# EAGLE board urdevboard (EAGLE 5.06), part 1 of 3
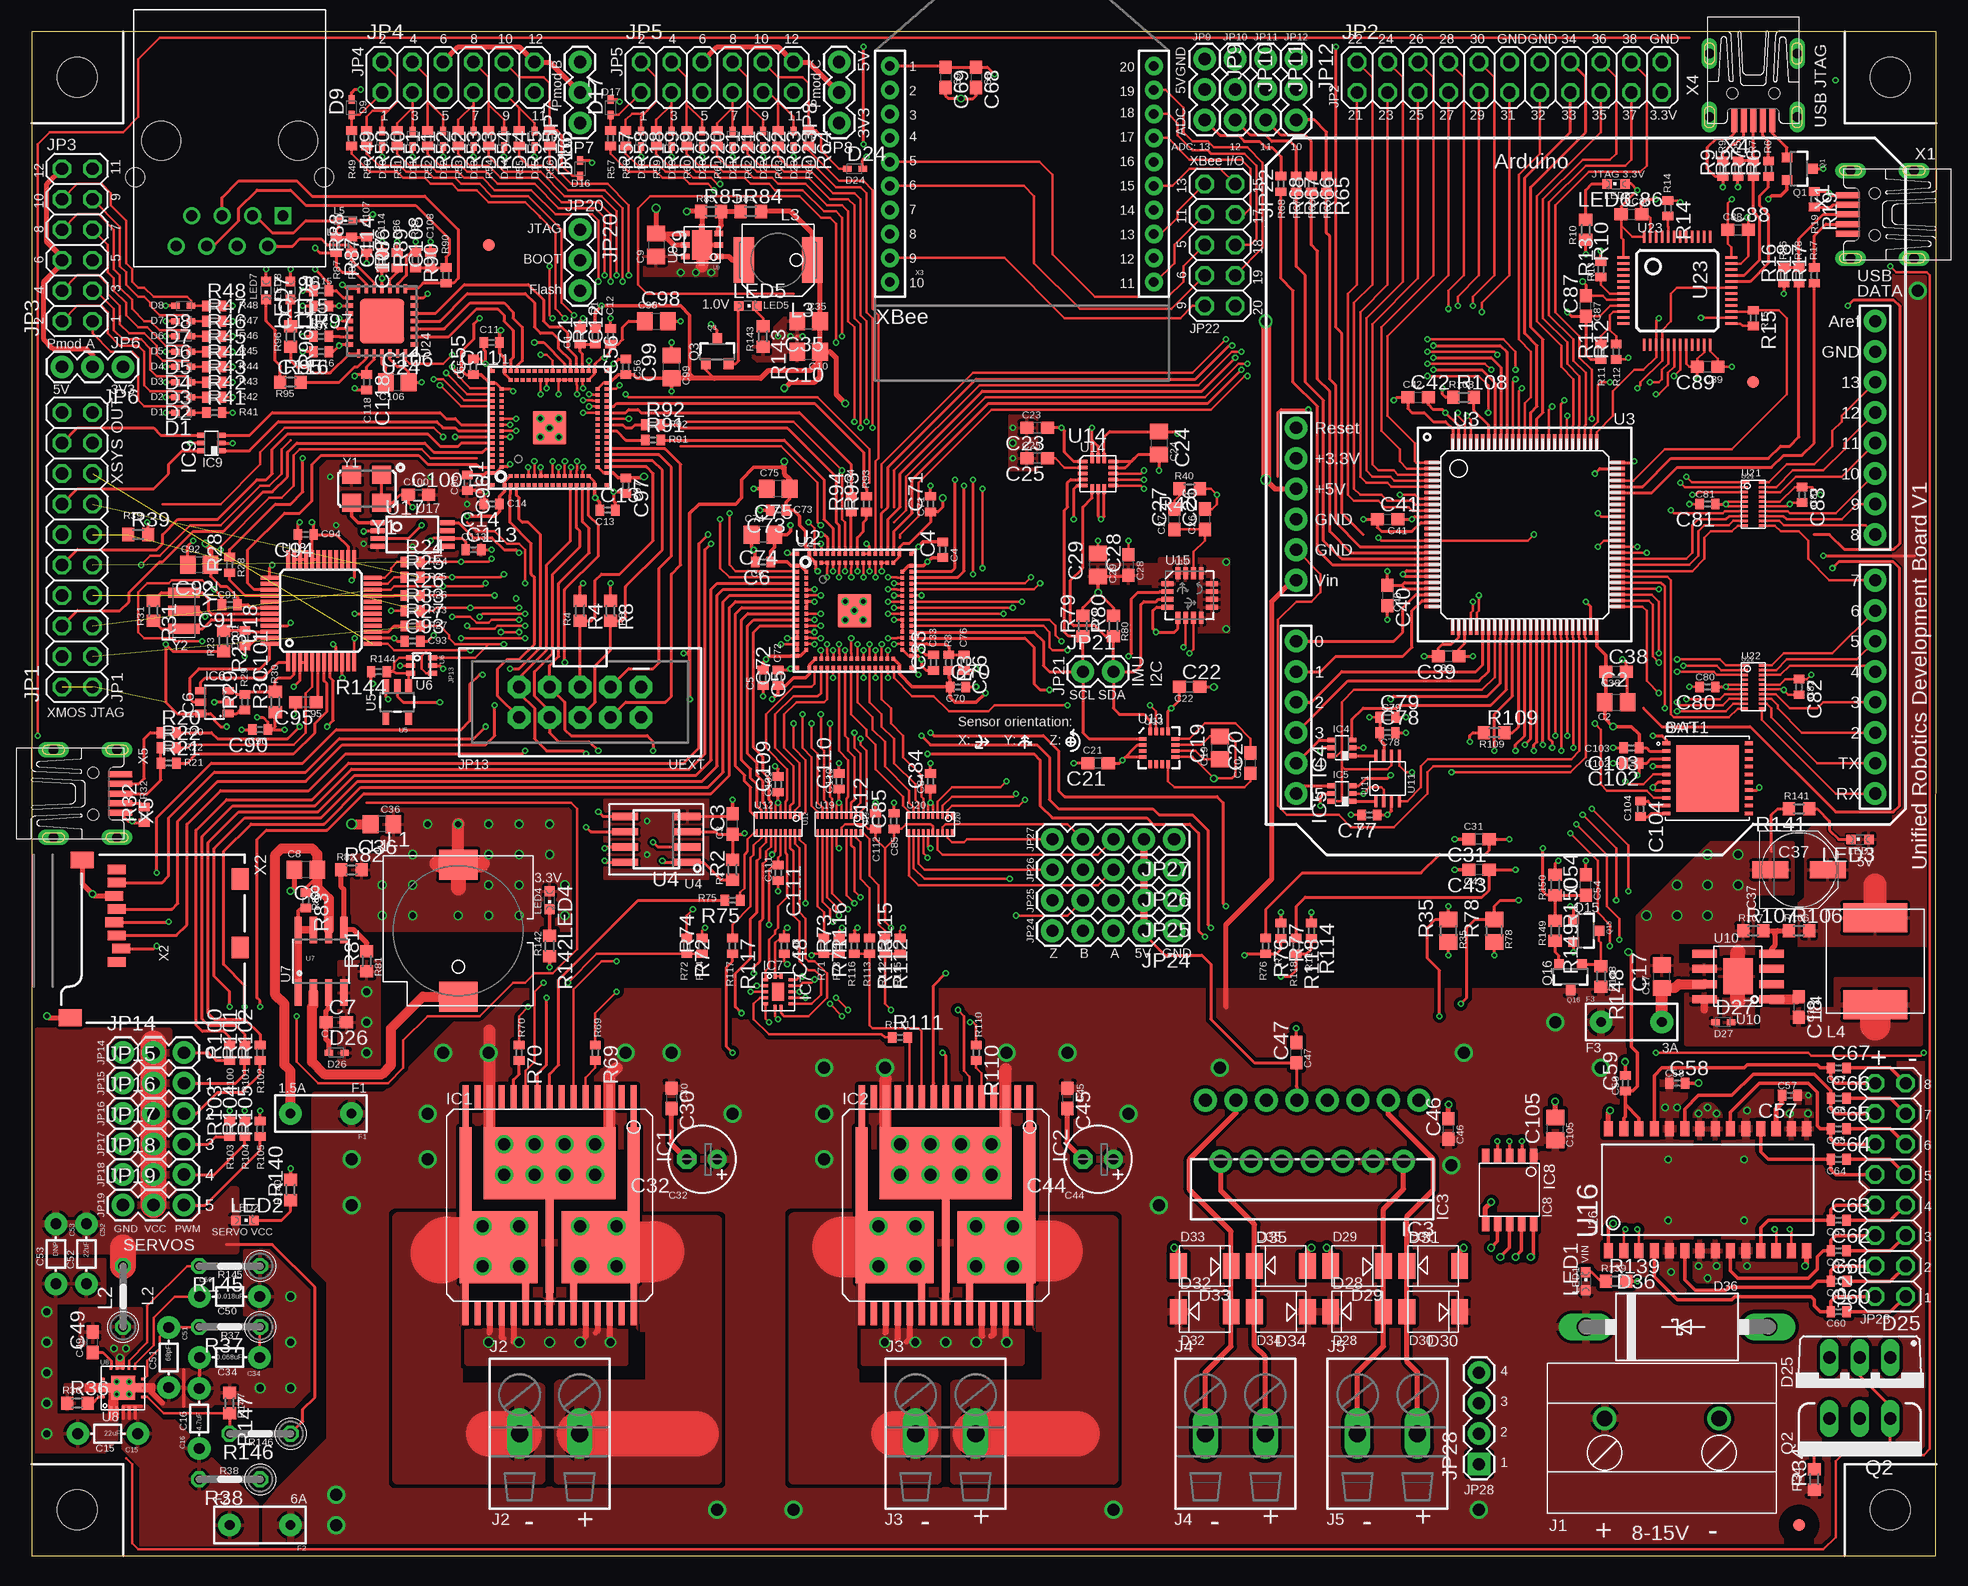
[diagram p16: board, top side]
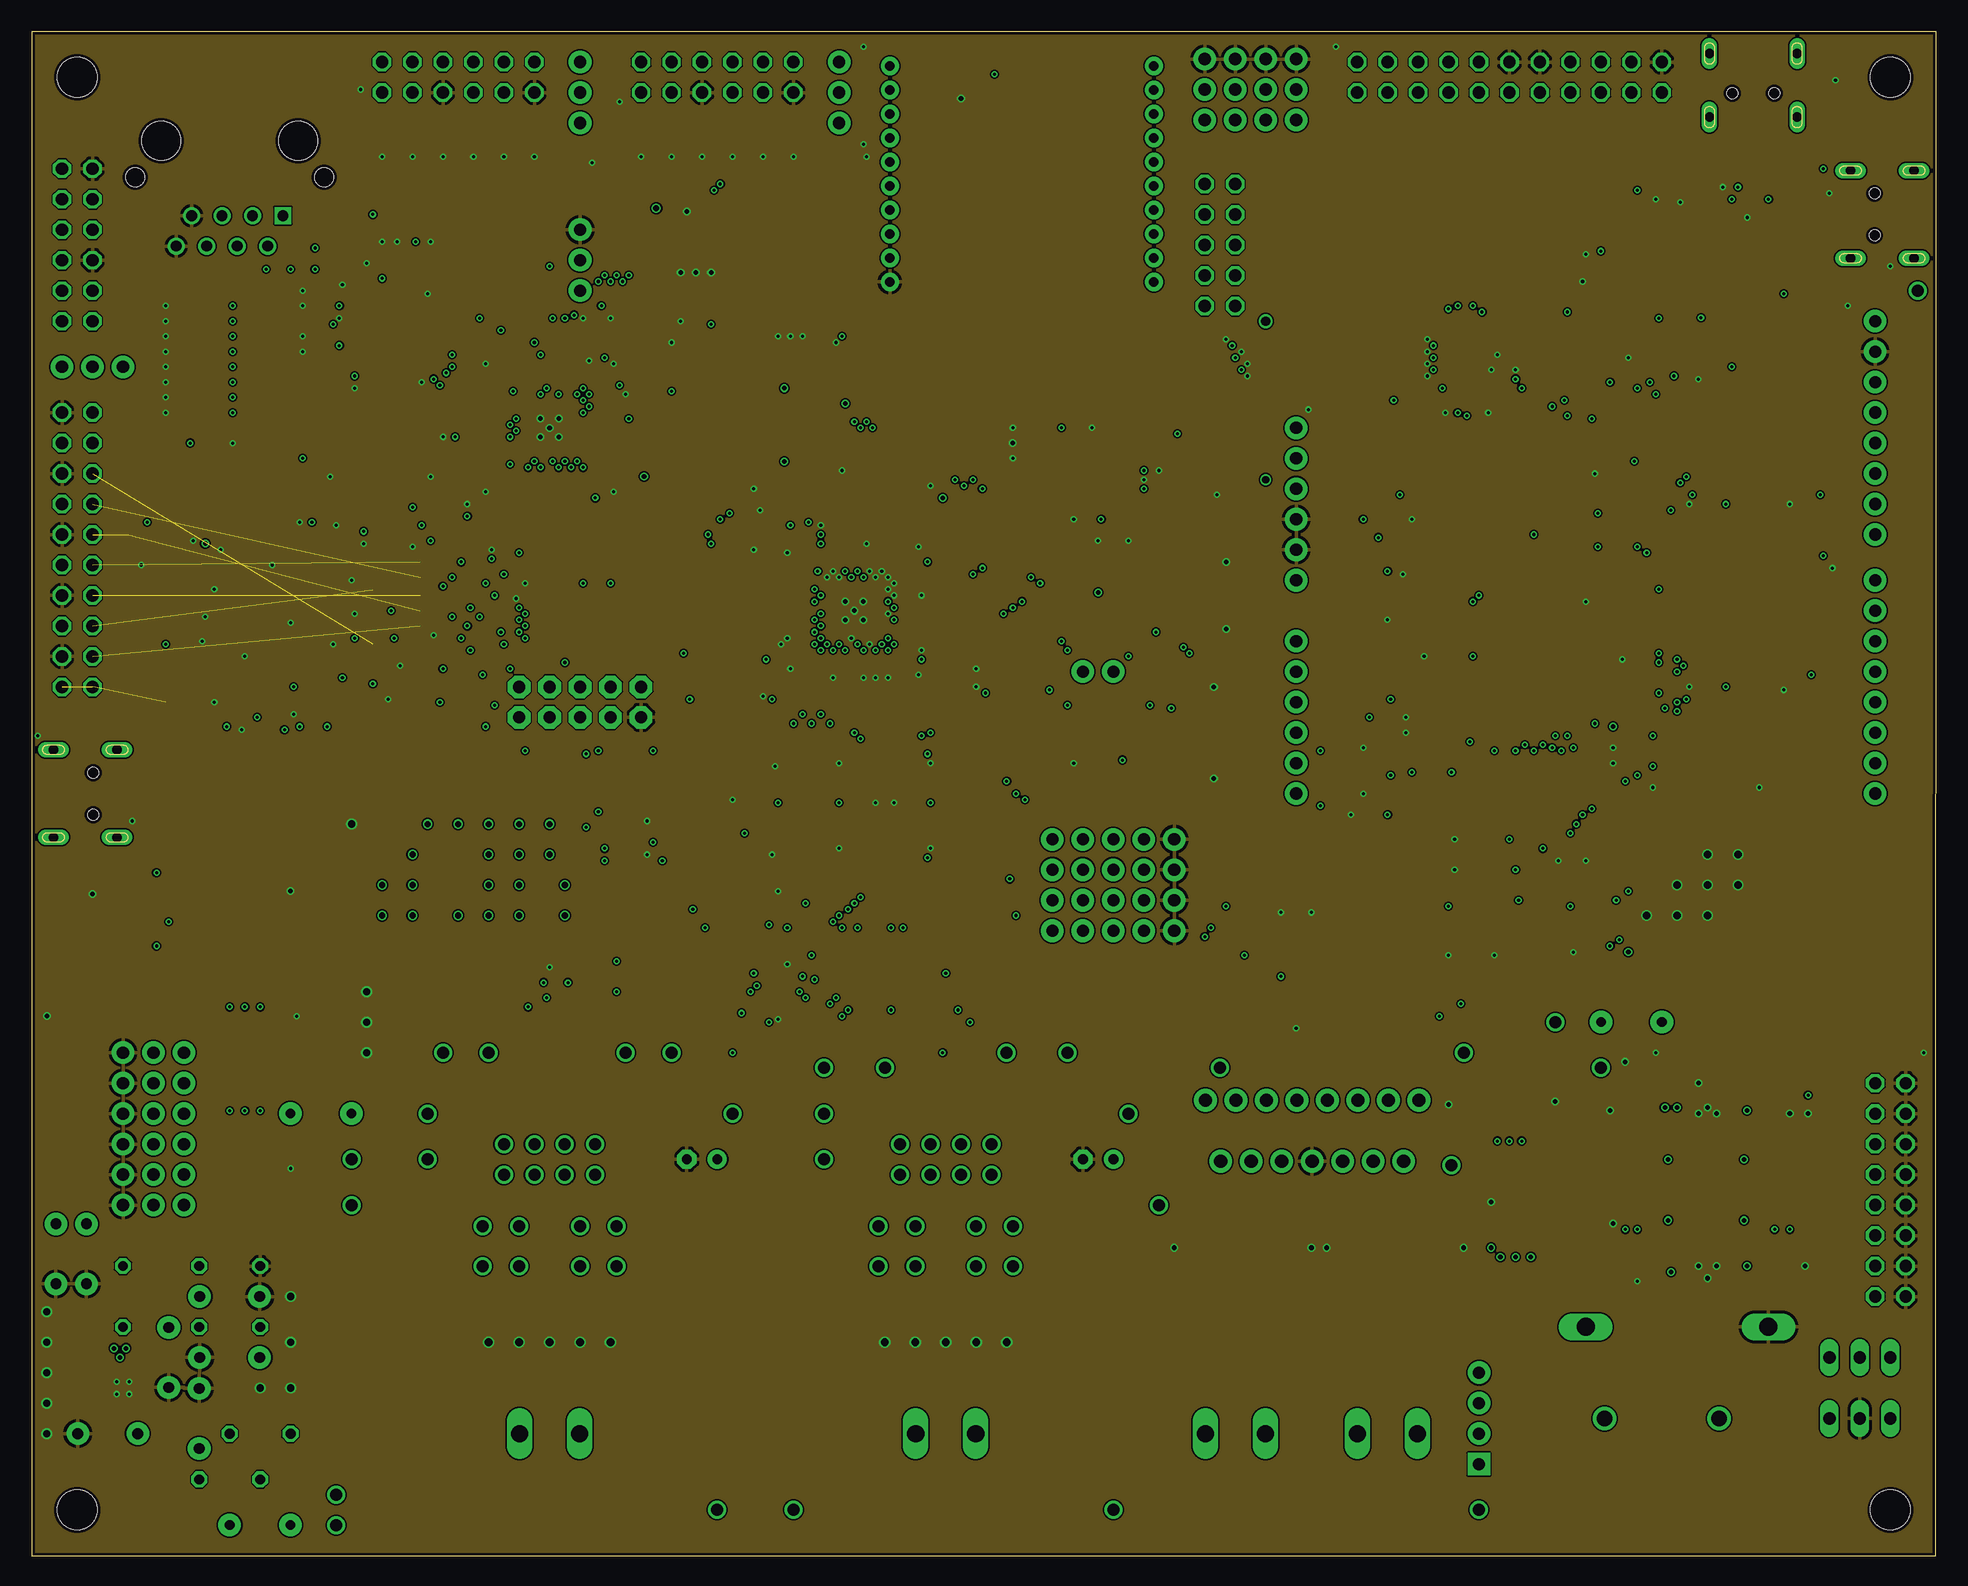
[diagram p17: board, inner layer $Ground]
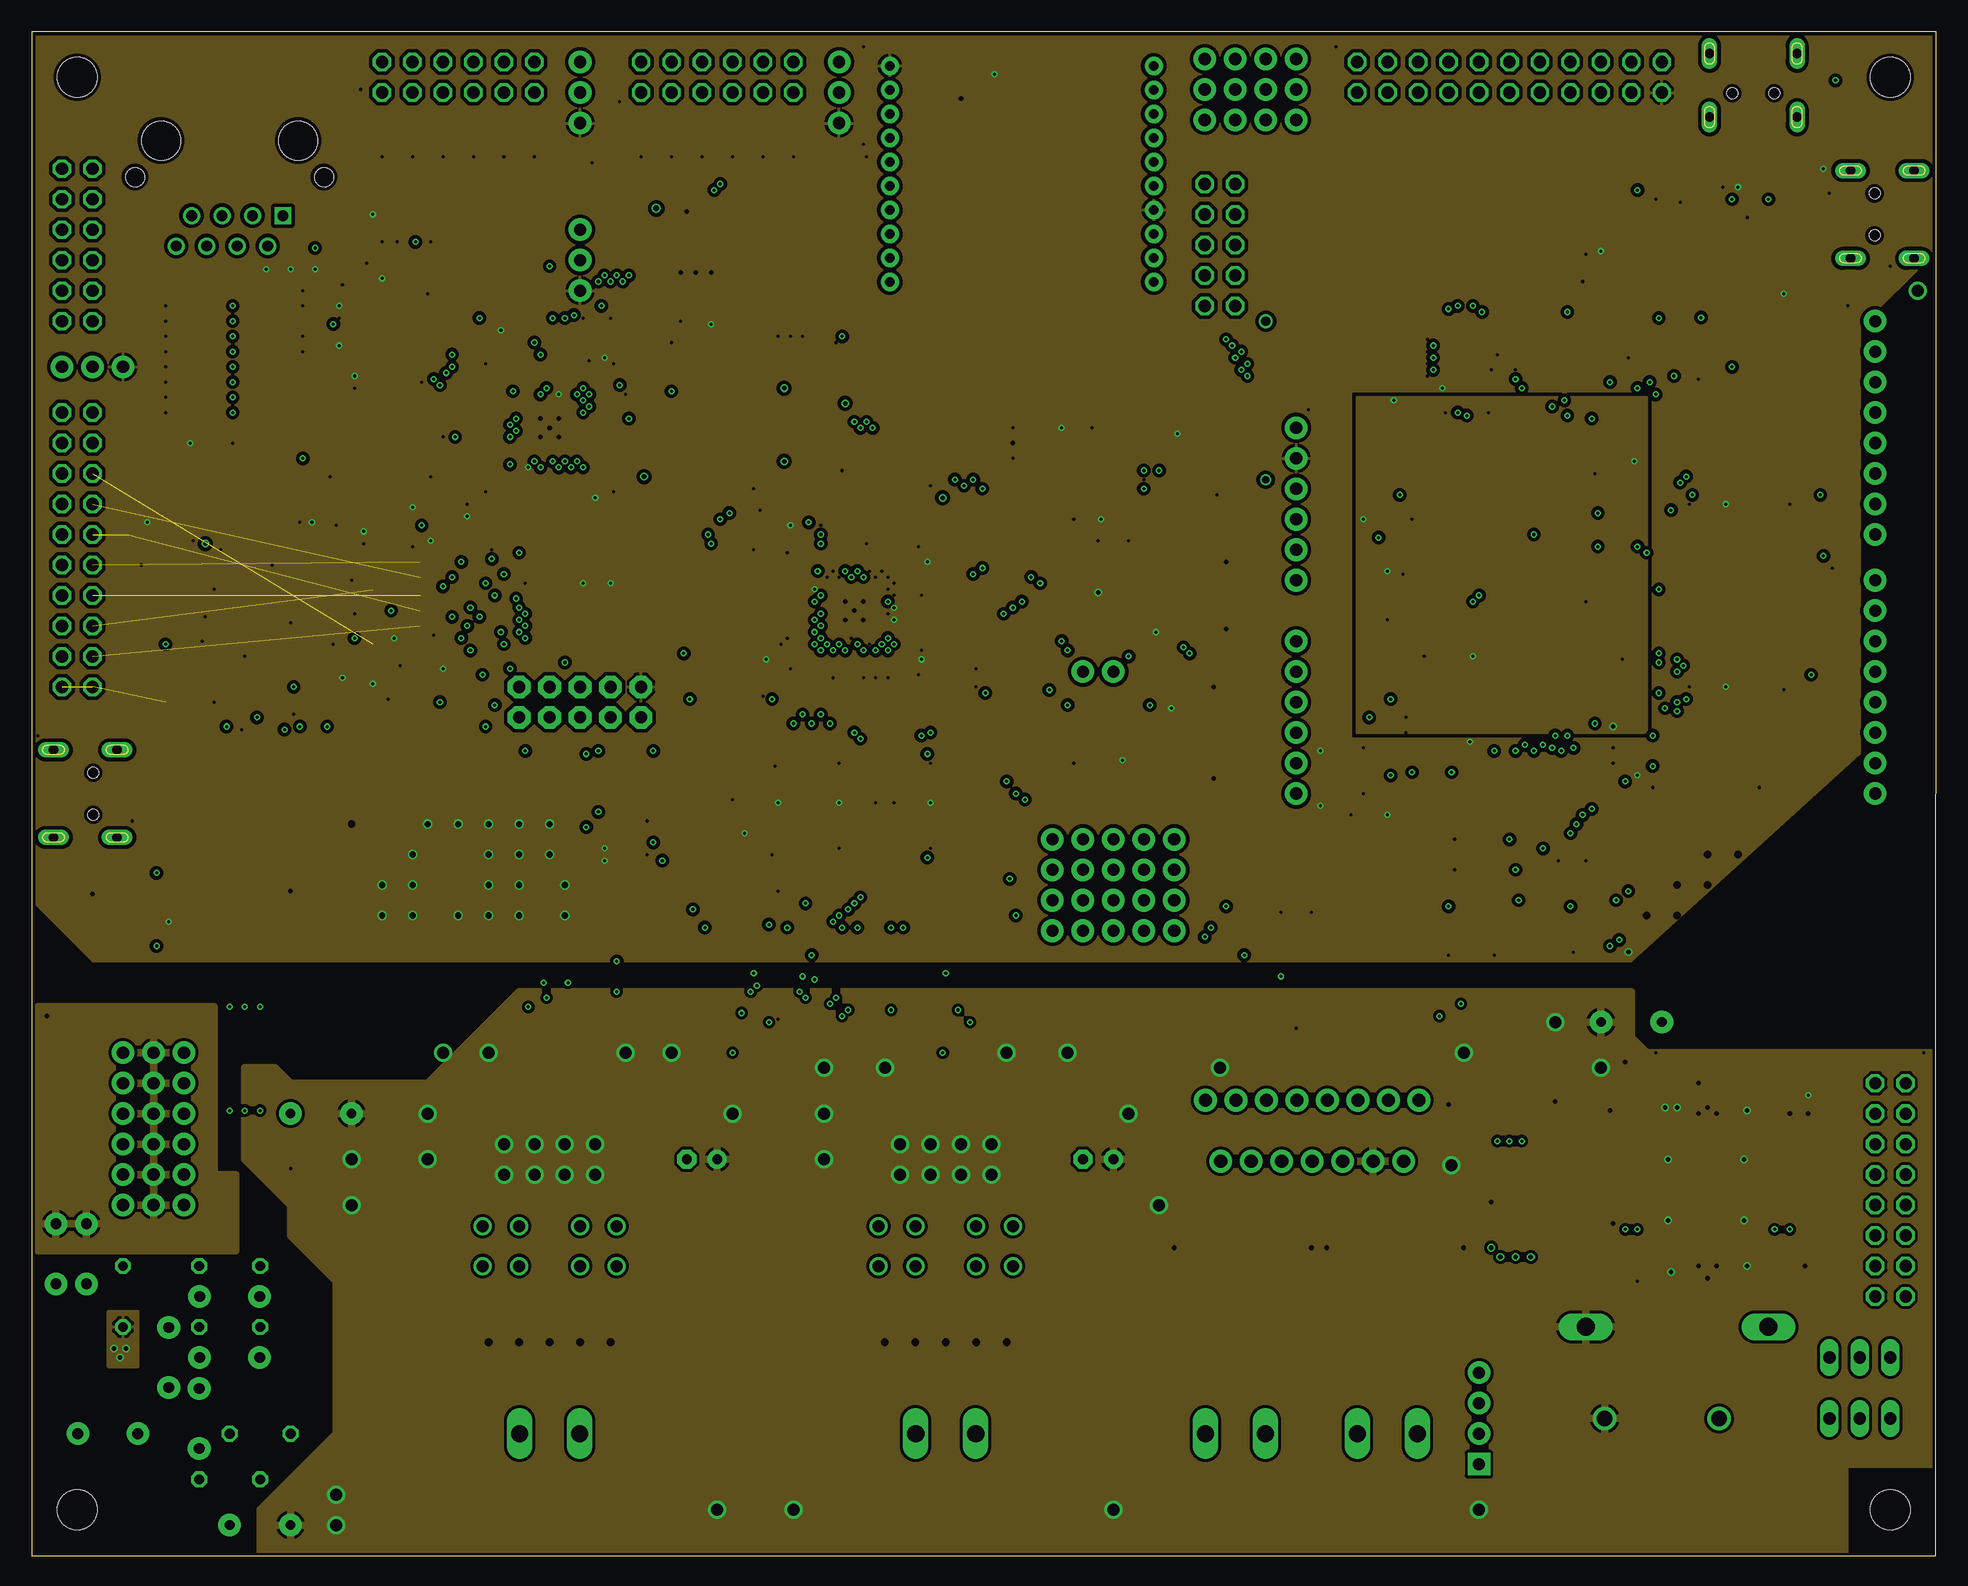
[diagram p18: board, inner layer $Power]
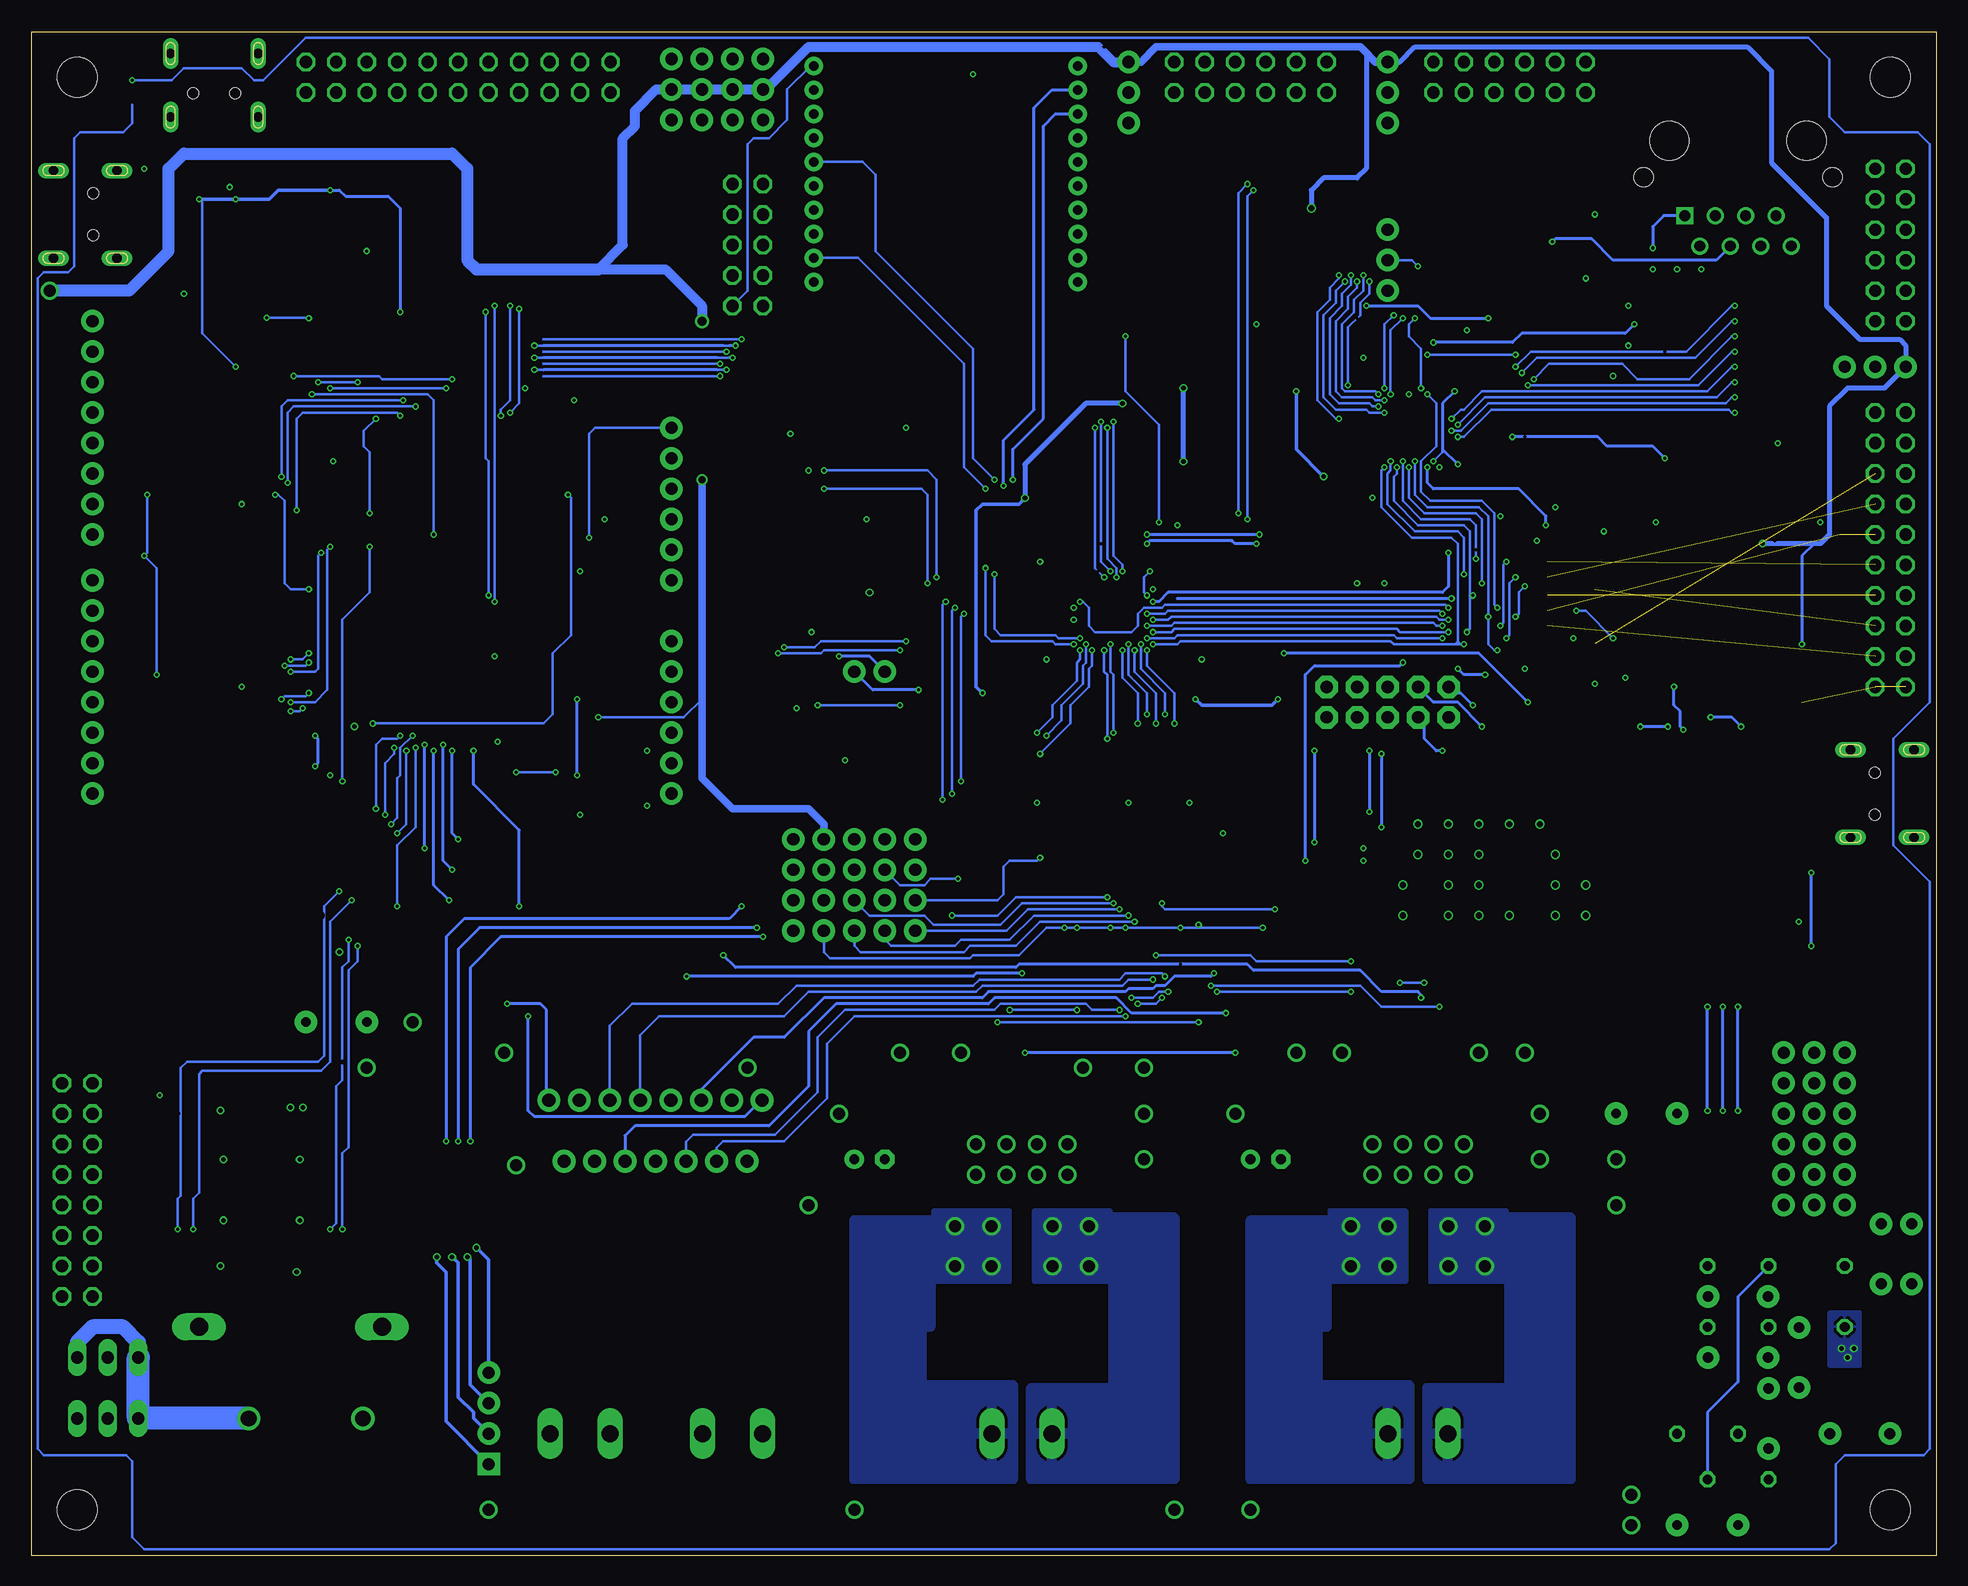
[diagram p19: board, bottom side, seen from below]

Size 158.75 x 127 mm. Coordinates in mm from the lower left corner, seen from the top.
Outline: 0,0 158.73,0 158.75,127 0,127 0,0
Copper layers [15:((1*2)+(15*16))]: Top 0.035mm / dielectric 0.2mm / $Ground 0.035mm / dielectric 1mm / $Power 0.035mm / dielectric 0.2mm / Bottom 0.035mm
Design rules "unified-4": minimum track width 7mil, minimum drill 10mil, track to track 5mil, track to pad 6mil, pad to pad 6mil, via to via 6mil, smd to smd 6mil, copper to edge 10mil, drill to drill 7mil, minimum pad ring 10mil, minimum via ring 5mil, stop-mask expansion 4mil, vias tented up to drill 25mil, thermal gap 10mil
tRestrict: area 0,119.4 to 7.6,127; area 151.1,119.4 to 158.8,127; area 151.1,0 to 158.8,7.6; area 0,0 to 7.6,7.6; area 146,1.3 to 148.6,3.8; area 142.2,96.5 to 144.8,99.1; area 36.8,108 to 39.4,110.5; area 69.8,31.7 to 70.6,33.5; area 81.8,31.7 to 82.5,33.5; area 36.8,31.7 to 37.6,33.5; area 48.8,31.7 to 49.5,33.5; area 71.9,35.8 to 80.5,37.1; 1 more areas

## Footprints (pad centres in the part's own frame; a part is rotated, then mirrored left to right if it is on the bottom)
D7C-DFN20 = smd 0.686 x 0.305: 1 -3.436,2.925; 2 -3.436,2.275; 3 -3.436,1.625; 4 -3.436,0.975; 5 -3.436,0.325; 6 -3.436,-0.325; 7 -3.436,-0.975; 8 -3.436,-1.625; 9 -3.436,-2.275; 10 -3.436,-2.925; 11 3.436,-2.925; 12 3.436,-2.275; 13 3.436,-1.625; 14 3.436,-0.975; 15 3.436,-0.325; 16 3.436,0.325; 17 3.436,0.975; 18 3.436,1.625; 19 3.436,2.275; 20 3.436,2.925 | smd 5.232 x 5.537: P$1 0,0
C0402 = smd 0.7 x 0.9: 1 -0.65,0; 2 0.65,0
C0805 = smd 1.3 x 1.5: 1 -0.95,0; 2 0.95,0
C0603 = smd 1.1 x 1: 1 -0.85,0; 2 0.85,0
AXIAL-5MM = drill 0.9 pad 1.88 round: P$1 -2.5,0; P$2 2.5,0
E2,5-6 = drill 0.813 pad 1.6 round: + -1.27,0 | drill 0.813 pad 1.6 octagon: - 1.27,0
PANASONIC_D = smd 3 x 1.4: + 2.4,0; - -2.4,0
SOD523 = smd 0.7 x 0.5: A 0.7,0; C -0.6,0
TO220ABS = drill 1.016 long: A1 -2.54,-2.54; A2 2.54,-2.54; C 0,-2.54
SOD128 = smd 1.4 x 2.1: A 2.2,0; C -2.2,0
DO201T15 = drill 1.499 long: A 7.62,0; C -7.62,0
PTC = drill 0.8 pad 1.88 round: P$1 -2.54,0; P$2 2.54,0
MULTIPOWERSO-30 = smd 0.508 x 12: 1 -7,-4; 15 7,-4; 16 7,4; 30 -7,4 | smd 0.508 x 2: 2 -6,-9; 4 -4,-9; 5 -3,-9; 6 -2,-9; 7 -1,-9; 8 0,-9; 9 1,-9; 10 2,-9; 11 3,-9; 12 4,-9; 14 6,-9; 17 6,9; 18 5,9; 19 4,9; 20 3,9; 22 1,9; 24 -1,9; 26 -3,9; 27 -4,9; 28 -5,9; 29 -6,9 | smd 0.508 x 4: 3 -5,-8; 13 5,-8; 21 2,8; 23 0,8; 25 -2,8 | smd 6.5 x 6: OUTA -4.25,3.5; OUTB 4.25,3.5 | smd 1 x 7.5: OUTA@1 -7,-2.755; OUTB@1 7,-2.755 | smd 11 x 6: VCC 0,-3.5 | smd 0.65 x 8.3: VCC@1 0,3.145
MULTIWATT15 = drill 1.1 pad 1.9 round: 1 -8.95,-2.39; 2 -7.68,2.69; 3 -6.41,-2.39; 4 -5.14,2.69; 5 -3.87,-2.39; 6 -2.6,2.69; 7 -1.33,-2.39; 8 -0.06,2.69; 9 1.21,-2.39; 10 2.48,2.69; 11 3.75,-2.39; 12 5.02,2.69; 13 6.29,-2.39; 14 7.56,2.69; 15 8.83,-2.39
DCK_R-PDSO-G6 = smd 0.4 x 0.7: 1 -0.65,-0.85; 2 0,-0.85; 3 0.65,-0.85; 4 0.65,0.85; 5 0,0.85; 6 -0.65,0.85
SOT23-6 = smd 0.6 x 0.9: 1 -0.95,-1.15; 2 0,-1.15; 3 0.95,-1.15; 4 0.95,1.15; 5 0,1.15; 6 -0.95,1.15
DHVQFN14 = smd 0.4 x 0.24: 1 -1.3,-0.25; 7 1.3,-0.25; 8 1.3,0.25; 14 -1.3,0.25 | smd 0.24 x 0.4: 2 -1,-1.05; 3 -0.5,-1.05; 4 0,-1.05; 5 0.5,-1.05; 6 1,-1.05; 9 1,1.05; 10 0.5,1.05; 11 0,1.05; 12 -0.5,1.05; 13 -1,1.05 | smd 1.5 x 1: PAD 0,0
LSOP-10 = smd 1.27 x 0.635: 1 -2.8,2; 2 -2.8,1; 3 -2.8,0; 4 -2.8,-1; 5 -2.8,-2; 6 2.8,-2; 7 2.8,-1; 8 2.8,0; 9 2.8,1; 10 2.8,2
ESPM02200 = drill 1.3 round: 1 -4.763,0; 2 4.763,0
796689-2 = drill 1.422 long: 1 -2.5,0; 2 2.5,0
SMJ102-S88I-DS-11 = drill 0.9 square: 1 -4.445,6.445 | drill 0.9 round: 2 -3.175,8.985; 3 -1.905,6.445; 4 -0.635,8.985; 5 0.635,6.445; 6 1.905,8.985; 7 3.175,6.445; 8 4.445,8.985 | hole 3.25: -5.715,0.195; 5.715,0.195 | hole 1.6: -7.875,3.245; 7.875,3.245
DUEMILANOVE_VIAS = drill 1.016 pad 1.88 round: 3.3V 50.8,13.97; 5V 50.8,16.51; A0 50.8,29.21; A1 50.8,31.75; A2 50.8,34.29; A3 50.8,36.83; A4 50.8,39.37; A5 50.8,41.91; AREF 2.54,2.54; D2 2.54,36.83; D3 2.54,34.29; D4 2.54,31.75; D5 2.54,29.21; D6 2.54,26.67; D7 2.54,24.13; D8 2.54,20.32; D9 2.54,17.78; D10 2.54,15.24; D11 2.54,12.7; D12 2.54,10.16; D13 2.54,7.62; GND@0 50.8,19.05; GND@1 50.8,21.59; GND@2 2.54,5.08; RES 50.8,11.43; RX 2.54,41.91; TX 2.54,39.37; VIN 50.8,24.13
2X10 = drill 1.016 octagon: 1 -11.43,-1.27; 2 -11.43,1.27; 3 -8.89,-1.27; 4 -8.89,1.27; 5 -6.35,-1.27; 6 -6.35,1.27; 7 -3.81,-1.27; 8 -3.81,1.27; 9 -1.27,-1.27; 10 -1.27,1.27; 11 1.27,-1.27; 12 1.27,1.27; 13 3.81,-1.27; 14 3.81,1.27; 15 6.35,-1.27; 16 6.35,1.27; 17 8.89,-1.27; 18 8.89,1.27; 19 11.43,-1.27; 20 11.43,1.27
2X11 = drill 1.016 octagon: 1 -12.7,-1.27; 2 -12.7,1.27; 3 -10.16,-1.27; 4 -10.16,1.27; 5 -7.62,-1.27; 6 -7.62,1.27; 7 -5.08,-1.27; 8 -5.08,1.27; 9 -2.54,-1.27; 10 -2.54,1.27; 11 0,-1.27; 12 0,1.27; 13 2.54,-1.27; 14 2.54,1.27; 15 5.08,-1.27; 16 5.08,1.27; 17 7.62,-1.27; 18 7.62,1.27; 19 10.16,-1.27; 20 10.16,1.27; 21 12.7,-1.27; 22 12.7,1.27
2X06 = drill 1.016 octagon: 1 -6.35,-1.27; 2 -6.35,1.27; 3 -3.81,-1.27; 4 -3.81,1.27; 5 -1.27,-1.27; 6 -1.27,1.27; 7 1.27,-1.27; 8 1.27,1.27; 9 3.81,-1.27; 10 3.81,1.27; 11 6.35,-1.27; 12 6.35,1.27
1X03 = drill 1.016 pad 1.88 round: 1 0,0; 2 2.54,0; 3 5.08,0
2X5-SHROUDED = drill 1.016 pad 1.88 octagon: 1 -1.27,5.08; 2 1.27,5.08; 3 -1.27,2.54; 4 1.27,2.54; 5 -1.27,0; 6 1.27,0; 7 -1.27,-2.54; 8 1.27,-2.54; 9 -1.27,-5.08; 10 1.27,-5.08
1X02 = drill 1.016 pad 1.88 round: 1 0,0; 2 2.54,0
2X05 = drill 1.016 octagon: 1 -5.08,-1.27; 2 -5.08,1.27; 3 -2.54,-1.27; 4 -2.54,1.27; 5 0,-1.27; 6 0,1.27; 7 2.54,-1.27; 8 2.54,1.27; 9 5.08,-1.27; 10 5.08,1.27
2X08 = drill 1.016 octagon: 1 -8.89,-1.27; 2 -8.89,1.27; 3 -6.35,-1.27; 4 -6.35,1.27; 5 -3.81,-1.27; 6 -3.81,1.27; 7 -1.27,-1.27; 8 -1.27,1.27; 9 1.27,-1.27; 10 1.27,1.27; 11 3.81,-1.27; 12 3.81,1.27; 13 6.35,-1.27; 14 6.35,1.27; 15 8.89,-1.27; 16 8.89,1.27
1X05 = drill 1.016 pad 1.88 round: 1 0,0; 2 2.54,0; 3 5.08,0; 4 7.62,0; 5 10.16,0
1X04 = drill 1.016 pad 1.88 square: 1 0,0 | drill 1.016 pad 1.88 round: 2 2.54,0; 3 5.08,0; 4 7.62,0
FIDUCIAL-1X2 = smd 1 x 1: 1 0,0
SLF12565 = smd 3.2 x 2.5: 1 0,-5.5; 2 0,5.5
0207/5V = drill 0.813 octagon: 1 -2.54,0; 2 2.54,0
PANASONIC_ELL6 = smd 1.7 x 3.8: 1 -2.85,0; 2 2.85,0
IHLP-3232DZ = smd 2.413 x 5.334: 1 -3.619,0; 2 3.619,0
0402 = smd 0.7 x 0.6: 1 -0.6,0; 2 0.6,0
CHIPLED_0603 = smd 0.8 x 0.8: A 0,-0.75; C 0,0.75
SOT23-3 = smd 0.8 x 0.9: 1 -0.95,-1; 2 0.95,-1; 3 0,1.1
TO220V = drill 1.016 long: 1 -2.54,0; 2 0,0; 3 2.54,0
R0402 = smd 0.7 x 0.9: 1 -0.65,0; 2 0.65,0
R0603 = smd 1 x 1.1: 1 -0.85,0; 2 0.85,0
R0805 = smd 1.3 x 1.5: 1 -0.95,0; 2 0.95,0
124QFN = smd 0.3 x 0.3: A1 -4.75,4.75; A2 -4.75,3.75; A3 -4.75,3.25; A4 -4.75,2.75; A5 -4.75,2.25; A6 -4.75,1.75; A7 -4.75,1.25; A8 -4.75,0.75; A9 -4.75,0.25; A10 -4.75,-0.25; A11 -4.75,-0.75; A12 -4.75,-1.25; A13 -4.75,-1.75; A14 -4.75,-2.25; A15 -4.75,-2.75; A16 -4.75,-3.25; A17 -4.75,-3.75; A18 -4.75,-4.75; A19 -3.75,-4.75; A20 -3.25,-4.75; A21 -2.75,-4.75; A22 -2.25,-4.75; A23 -1.75,-4.75; A24 -1.25,-4.75; A25 -0.75,-4.75; A26 -0.25,-4.75; A27 0.25,-4.75; A28 0.75,-4.75; A29 1.25,-4.75; A30 1.75,-4.75; A31 2.25,-4.75; A32 2.75,-4.75; A33 3.25,-4.75; A34 3.75,-4.75; A35 4.75,-4.75; A36 4.75,-3.75; A37 4.75,-3.25; A38 4.75,-2.75; A39 4.75,-2.25; A40 4.75,-1.75; A41 4.75,-1.25; A42 4.75,-0.75; A43 4.75,-0.25; A44 4.75,0.25; A45 4.75,0.75; A46 4.75,1.25; A47 4.75,1.75; A48 4.75,2.25; A49 4.75,2.75; A50 4.75,3.25; A51 4.75,3.75; A52 4.75,4.75; A53 3.75,4.75; A54 3.25,4.75; A55 2.75,4.75; A56 2.25,4.75; A57 1.75,4.75; A58 1.25,4.75; A59 0.75,4.75; A60 0.25,4.75; A61 -0.25,4.75; A62 -0.75,4.75; A63 -1.25,4.75; A64 -1.75,4.75; A65 -2.25,4.75; A66 -2.75,4.75; A67 -3.25,4.75; A68 -3.75,4.75; B1 -4,3.25; B2 -4,2.75; B3 -4,2.25; B4 -4,1.75; B5 -4,1.25; B6 -4,0.75; B7 -4,0.25; B8 -4,-0.25; B9 -4,-0.75; B10 -4,-1.25; B11 -4,-1.75; B12 -4,-2.25; B13 -4,-2.75; B14 -4,-3.25; B15 -3.25,-4; B16 -2.75,-4; B17 -2.25,-4; B18 -1.75,-4; B19 -1.25,-4; B20 -0.75,-4; B21 -0.25,-4; B22 0.25,-4; B23 0.75,-4; B24 1.25,-4; B25 1.75,-4; B26 2.25,-4; B27 2.75,-4; B28 3.25,-4; B29 4,-3.25; B30 4,-2.75; B31 4,-2.25; B32 4,-1.75; B33 4,-1.25; B34 4,-0.75; B35 4,-0.25; B36 4,0.25; B37 4,0.75; B38 4,1.25; B39 4,1.75; B40 4,2.25; B41 4,2.75; B42 4,3.25; B43 3.25,4; B44 2.75,4; B45 2.25,4; B46 1.75,4; B47 1.25,4; B48 0.75,4; B49 0.25,4; B50 -0.25,4; B51 -0.75,4; B52 -1.25,4; B53 -1.75,4; B54 -2.25,4; B55 -2.75,4; B56 -3.25,4 | smd 2.8 x 2.8: PAD 0,0
LQFP100 = smd 1.2 x 0.3: 1 -7.75,6; 2 -7.75,5.5; 3 -7.75,5; 4 -7.75,4.5; 5 -7.75,4; 6 -7.75,3.5; 7 -7.75,3; 8 -7.75,2.5; 9 -7.75,2; 10 -7.75,1.5; 11 -7.75,1; 12 -7.75,0.5; 13 -7.75,0; 14 -7.75,-0.5; 15 -7.75,-1; 16 -7.75,-1.5; 17 -7.75,-2; 18 -7.75,-2.5; 19 -7.75,-3; 20 -7.75,-3.5; 21 -7.75,-4; 22 -7.75,-4.5; 23 -7.75,-5; 24 -7.75,-5.5; 25 -7.75,-6; 51 7.75,-6; 52 7.75,-5.5; 53 7.75,-5; 54 7.75,-4.5; 55 7.75,-4; 56 7.75,-3.5; 57 7.75,-3; 58 7.75,-2.5; 59 7.75,-2; 60 7.75,-1.5; 61 7.75,-1; 62 7.75,-0.5; 63 7.75,0; 64 7.75,0.5; 65 7.75,1; 66 7.75,1.5; 67 7.75,2; 68 7.75,2.5; 69 7.75,3; 70 7.75,3.5; 71 7.75,4; 72 7.75,4.5; 73 7.75,5; 74 7.75,5.5; 75 7.75,6 | smd 0.3 x 1.2: 26 -6,-7.75; 27 -5.5,-7.75; 28 -5,-7.75; 29 -4.5,-7.75; 30 -4,-7.75; 31 -3.5,-7.75; 32 -3,-7.75; 33 -2.5,-7.75; 34 -2,-7.75; 35 -1.5,-7.75; 36 -1,-7.75; 37 -0.5,-7.75; 38 0,-7.75; 39 0.5,-7.75; 40 1,-7.75; 41 1.5,-7.75; 42 2,-7.75; 43 2.5,-7.75; 44 3,-7.75; 45 3.5,-7.75; 46 4,-7.75; 47 4.5,-7.75; 48 5,-7.75; 49 5.5,-7.75; 50 6,-7.75; 76 6,7.75; 77 5.5,7.75; 78 5,7.75; 79 4.5,7.75; 80 4,7.75; 81 3.5,7.75; 82 3,7.75; 83 2.5,7.75; 84 2,7.75; 85 1.5,7.75; 86 1,7.75; 87 0.5,7.75; 88 0,7.75; 89 -0.5,7.75; 90 -1,7.75; 91 -1.5,7.75; 92 -2,7.75; 93 -2.5,7.75; 94 -3,7.75; 95 -3.5,7.75; 96 -4,7.75; 97 -4.5,7.75; 98 -5,7.75; 99 -5.5,7.75; 100 -6,7.75
SO-08 = smd 0.6 x 2.2: 1 -1.905,-2.6; 2 -0.635,-2.6; 3 0.635,-2.6; 4 1.905,-2.6; 5 1.905,2.6; 6 0.635,2.6; 7 -0.635,2.6; 8 -1.905,2.6
SOT23-5 = smd 0.55 x 1.2: 1 -0.95,-1.3; 2 0,-1.3; 3 0.95,-1.3; 4 0.95,1.3; 5 -0.95,1.3
SC70-6 = smd 0.4 x 0.75: 1 -0.65,-0.925; 2 0,-0.925; 3 0.65,-0.925; 4 0.65,0.925; 5 0,0.925; 6 -0.65,0.925
SO08 = smd 0.61 x 2.21: 1 -1.905,-2.616; 2 -0.635,-2.616; 3 0.635,-2.616; 4 1.905,-2.616; 5 1.905,2.616; 6 0.635,2.616; 7 -0.635,2.616; 8 -1.905,2.616
S-PVQFN-N14 = smd 0.3 x 0.18: 1 -1.675,-0.75; 7 1.675,-0.75; 8 1.675,0.75; 14 -1.675,0.75 | smd 0.18 x 0.3: 2 -1,-1.675; 3 -0.5,-1.675; 4 0,-1.675; 5 0.5,-1.675; 6 1,-1.675; 9 1,1.675; 10 0.5,1.675; 11 0,1.675; 12 -0.5,1.675; 13 -1,1.675 | smd 2 x 2: PAD1 0,0 | smd 0.825 x 0.18: PAD2 -1.425,-0.25; PAD3 1.425,-0.25; PAD5 1.425,0.25; PAD6 -1.425,0.25 | smd 0.525 x 0.32: PAD4 1.275,0; PAD7 -1.275,0
MLP6 = smd 0.7 x 0.45: 1 -1.4,0.95; 2 -1.4,0; 3 -1.4,-0.95; 4 1.4,-0.95; 5 1.4,0; 6 1.4,0.95 | smd 0.45 x 0.525: PADA 0,1.475; PADC 0,-1.475 | smd 1.65 x 2.45: PADB 0,0
R-PDSO-G08 = smd 2.032 x 0.66: 1 -2.794,1.905; 2 -2.794,0.635; 3 -2.794,-0.635; 4 -2.794,-1.905; 5 2.794,-1.905; 6 2.794,-0.635; 7 2.794,0.635; 8 2.794,1.905 | smd 2.489 x 2.997: PAD 0,0
DCT-R-PDSO-G8 = smd 0.26 x 1: 1 -0.975,-1.9; 2 -0.325,-1.9; 3 0.325,-1.9; 4 0.975,-1.9; 5 0.975,1.9; 6 0.325,1.9; 7 -0.325,1.9; 8 -0.975,1.9
DQS_R-PUSON-N20 = smd 0.2 x 0.65: 1 -1.8,-0.675 | smd 0.2 x 0.55: 2 -1.4,-0.725; 3 -1,-0.725; 4 -0.6,-0.725; 5 -0.2,-0.725; 6 0.2,-0.725; 7 0.6,-0.725; 8 1,-0.725; 9 1.4,-0.725; 10 1.8,-0.725; 11 1.8,0.725; 12 1.4,0.725; 13 1,0.725; 14 0.6,0.725; 15 0.2,0.725; 16 -0.2,0.725; 17 -0.6,0.725; 18 -1,0.725; 19 -1.4,0.725; 20 -1.8,0.725
16LPCC = smd 0.65 x 0.28: 1 -1.37,0.75; 2 -1.37,0.25; 3 -1.37,-0.25; 4 -1.37,-0.75; 9 1.37,-0.75; 10 1.37,-0.25; 11 1.37,0.25; 12 1.37,0.75 | smd 0.28 x 0.65: 5 -0.75,-1.37; 6 -0.25,-1.37; 7 0.25,-1.37; 8 0.75,-1.37; 13 0.75,1.37; 14 0.25,1.37; 15 -0.25,1.37; 16 -0.75,1.37
VQFN-16 = smd 0.8 x 0.3: 1 -1.275,1; 2 -1.275,0.5; 3 -1.275,0; 4 -1.275,-0.5; 5 -1.275,-1; 9 1.275,-1; 10 1.275,-0.5; 11 1.275,0; 12 1.275,0.5; 13 1.275,1 | smd 0.3 x 0.8: 6 -0.5,-1.275; 7 0,-1.275; 8 0.5,-1.275; 14 0.5,1.275; 15 0,1.275; 16 -0.5,1.275
LGA16-4X4 = smd 1 x 0.4: 1 -1.85,0.975; 2 -1.85,0.325; 3 -1.85,-0.325; 4 -1.85,-0.975; 9 1.85,-0.975; 10 1.85,-0.325; 11 1.85,0.325; 12 1.85,0.975 | smd 0.4 x 1: 5 -0.975,-1.85; 6 -0.325,-1.85; 7 0.325,-1.85; 8 0.975,-1.85; 13 0.975,1.85; 14 0.325,1.85; 15 -0.325,1.85; 16 -0.975,1.85
SO-28W = smd 0.762 x 1.27: 1 -8.255,-5.08; 2 -6.985,-5.08; 3 -5.715,-5.08; 4 -4.445,-5.08; 5 -3.175,-5.08; 6 -1.905,-5.08; 7 -0.635,-5.08; 8 0.635,-5.08; 9 1.905,-5.08; 10 3.175,-5.08; 11 4.445,-5.08; 12 5.715,-5.08; 13 6.985,-5.08; 14 8.255,-5.08; 15 8.255,5.08; 16 6.985,5.08; 17 5.715,5.08; 18 4.445,5.08; 19 3.175,5.08; 20 1.905,5.08; 21 0.635,5.08; 22 -0.635,5.08; 23 -1.905,5.08; 24 -3.175,5.08; 25 -4.445,5.08; 26 -5.715,5.08; 27 -6.985,5.08; 28 -8.255,5.08
PW_R-PDSO-G08 = smd 0.4 x 1.2: 1 -0.975,-2.9; 2 -0.325,-2.9; 3 0.325,-2.9; 4 0.975,-2.9; 5 0.975,2.9; 6 0.325,2.9; 7 -0.325,2.9; 8 -0.975,2.9
PQFP48 = smd 1.5 x 0.35: 1 -4.3,2.75; 2 -4.3,2.25; 3 -4.3,1.75; 4 -4.3,1.25; 5 -4.3,0.75; 6 -4.3,0.25; 7 -4.3,-0.25; 8 -4.3,-0.75; 9 -4.3,-1.25; 10 -4.3,-1.75; 11 -4.3,-2.25; 12 -4.3,-2.75; 25 4.3,-2.75; 26 4.3,-2.25; 27 4.3,-1.75; 28 4.3,-1.25; 29 4.3,-0.75; 30 4.3,-0.25; 31 4.3,0.25; 32 4.3,0.75; 33 4.3,1.25; 34 4.3,1.75; 35 4.3,2.25; 36 4.3,2.75 | smd 0.35 x 1.5: 13 -2.75,-4.3; 14 -2.25,-4.3; 15 -1.75,-4.3; 16 -1.25,-4.3; 17 -0.75,-4.3; 18 -0.25,-4.3; 19 0.25,-4.3; 20 0.75,-4.3; 21 1.25,-4.3; 22 1.75,-4.3; 23 2.25,-4.3; 24 2.75,-4.3; 37 2.75,4.3; 38 2.25,4.3; 39 1.75,4.3; 40 1.25,4.3; 41 0.75,4.3; 42 0.25,4.3; 43 -0.25,4.3; 44 -0.75,4.3; 45 -1.25,4.3; 46 -1.75,4.3; 47 -2.25,4.3; 48 -2.75,4.3
TQFP48 = smd 0.2 x 1: 1 -2.75,-4.5; 2 -2.25,-4.5; 3 -1.75,-4.5; 4 -1.25,-4.5; 5 -0.75,-4.5; 6 -0.25,-4.5; 7 0.25,-4.5; 8 0.75,-4.5; 9 1.25,-4.5; 10 1.75,-4.5; 11 2.25,-4.5; 12 2.75,-4.5; 25 2.75,4.5; 26 2.25,4.5; 27 1.75,4.5; 28 1.25,4.5; 29 0.75,4.5; 30 0.25,4.5; 31 -0.25,4.5; 32 -0.75,4.5; 33 -1.25,4.5; 34 -1.75,4.5; 35 -2.25,4.5; 36 -2.75,4.5 | smd 1 x 0.2: 13 4.5,-2.75; 14 4.5,-2.25; 15 4.5,-1.75; 16 4.5,-1.25; 17 4.5,-0.75; 18 4.5,-0.25; 19 4.5,0.25; 20 4.5,0.75; 21 4.5,1.25; 22 4.5,1.75; 23 4.5,2.25; 24 4.5,2.75; 37 -4.5,2.75; 38 -4.5,2.25; 39 -4.5,1.75; 40 -4.5,1.25; 41 -4.5,0.75; 42 -4.5,0.25; 43 -4.5,-0.25; 44 -4.5,-0.75; 45 -4.5,-1.25; 46 -4.5,-1.75; 47 -4.5,-2.25; 48 -4.5,-2.75
QFN28-ML_6X6MM = smd 0.7 x 0.35: 1 -2.7,1.95; 2 -2.7,1.3; 3 -2.7,0.65; 4 -2.7,0; 5 -2.7,-0.65; 6 -2.7,-1.3; 7 -2.7,-1.95; 15 2.7,-1.95; 16 2.7,-1.3; 17 2.7,-0.65; 18 2.7,0; 19 2.7,0.65; 20 2.7,1.3; 21 2.7,1.95 | smd 0.35 x 0.7: 8 -1.95,-2.7; 9 -1.3,-2.7; 10 -0.65,-2.7; 11 0,-2.7; 12 0.65,-2.7; 13 1.3,-2.7; 14 1.95,-2.7; 22 1.95,2.7; 23 1.3,2.7; 24 0.65,2.7; 25 0,2.7; 26 -0.65,2.7; 27 -1.3,2.7; 28 -1.95,2.7 | smd 3.7 x 3.7: EXP 0,0
STAND-OFF = hole 3.302: 0,0
UX60-MB-5S8 = smd 2 x 0.5: 1 8.65,1.6; 2 8.65,0.8; 3 8.65,0; 4 8.65,-0.8; 5 8.65,-1.6 | drill 0.8 long: M1 3.1,-3.65; M2 3.1,3.65; M3 8.4,3.65; M4 8.4,-3.65 | hole 0.9: 6.4,-1.75; 6.4,1.75
MICRO-SD-SOCKET-PP = smd 0.8 x 1.5: 1 -8.94,10.7; 2 -7.84,10.3; 3 -6.74,10.7; 4 -5.64,10.9; 5 -4.54,10.7; 6 -3.44,10.9; 7 -2.34,10.7; 8 -1.24,10.7 | smd 1.8 x 1.4: CD1 -2.05,0.4; CD2 -7.75,0.4 | smd 1.4 x 1.9: GND1 -13.6,14.55; GND3 -0.45,13.55
XBEE-1 = drill 0.8 pad 1.524 round: 1 -11,20; 2 -11,18; 3 -11,16; 4 -11,14; 5 -11,12; 6 -11,10; 7 -11,8; 8 -11,6; 9 -11,4; 10 -11,2; 11 11,2; 12 11,4; 13 11,6; 14 11,8; 15 11,10; 16 11,12; 17 11,14; 18 11,16; 19 11,18; 20 11,20
ASF = smd 1.6 x 1.5: 1 -1.25,-1.15; 2 1.25,-1.15; 3 1.25,1.15; 4 -1.25,1.15
CSTCR6M = smd 0.8 x 2.6: 1 -1.5,0; 2 0,0; 3 1.5,0

## Placement (x,y rotation side)
BAT1  CBC3112  [D7C-DFN20]  139.7,64.77 0 top
C1  1uF  [C0402]  45.72,101.6 90 top
C2  10uF  [C0805]  132.08,71.12 0 top
C3  0.1uF  [C0603]  58.42,60.96 90 top
C4  0.1uF  [C0402]  75.95,83.82 90 top
C5  0.1uF  [C0402]  60.96,73.15 270 top
C6  0.1uF  [C0402]  60.96,82.8 180 top
C7  290pF  [C0603]  25.4,44.45 0 top
C8  100uF  [C0805]  22.86,57.15 180 top
C9  10uF  [C0805]  52.07,109.22 270 top
C10  10uF  [C0805]  64.77,100.33 180 top
C11  0.1uF  [C0402]  38.35,101.09 180 top
C12  0.1uF  [C0402]  48.26,101.6 90 top
C13  0.1uF  [C0402]  48.01,87.12 0 top
C14  0.1uF  [C0402]  38.35,87.63 180 top
C15  22uF  [AXIAL-5MM]  6.35,10.16 180 top
C16  4.7uF  [AXIAL-5MM]  13.97,11.43 90 top
C17  10uF  [C0805]  135.89,48.26 90 top
C18  0.01uF  [C0603]  147.32,45.72 270 top
C19  4.7uF  [C0805]  99.06,67.31 90 top
C20  0.22uF  [C0603]  101.6,66.04 90 top
C21  0.1uF  [C0603]  88.9,66.04 180 top
C22  0.1uF  [C0603]  96.52,72.39 0 top
C23  0.1uF  [C0603]  83.82,93.98 180 top
C24  4.7uF  [C0805]  93.98,92.71 270 top
C25  0.1uF  [C0603]  83.82,91.44 180 top
C26  10nF  [C0603]  97.79,86.36 90 top
C27  470nF  [C0603]  95.25,86.36 90 top
C28  0.1uF  [C0603]  91.44,82.55 90 top
C29  10uF  [C0805]  88.9,82.55 90 top
C30  0.1uF  [C0603]  53.34,38.1 270 top
C31  33nF  [C0603]  120.65,59.69 180 top
C32  500uF  [E2,5-6]  55.88,33.02 180 top
C33  0.1uF  [C0402]  75.18,74.42 90 top
C34  0.068uF  [AXIAL-5MM]  16.51,16.51 180 top
C35  10uF  [C0805]  64.77,102.87 180 top
C36  152uF  [C0805]  29.21,60.96 180 top
C37  220uF  [PANASONIC_D]  147.32,57.15 0 top
C38  0.1uF  [C0603]  132.08,73.66 0 top
C39  0.1uF  [C0603]  118.11,74.93 180 top
C40  0.1uF  [C0603]  113.03,80.01 270 top
C41  0.1uF  [C0603]  113.03,86.36 0 top
C42  0.1uF  [C0603]  115.57,96.52 0 top
C43  33nF  [C0603]  120.65,57.15 180 top
C44  500uF  [E2,5-6]  88.9,33.02 180 top
C45  0.1uF  [C0603]  86.36,38.1 270 top
C46  0.1uF  [C0603]  118.11,35.56 90 top
C47  0.1uF  [C0603]  105.41,41.91 90 top
C48  0.1uF  [C0402]  62.74,50.8 270 top
C49  0.1uF  [C0603]  5.08,17.78 90 top
C50  0.018uF  [AXIAL-5MM]  16.51,21.59 0 top
C51  68pF  [AXIAL-5MM]  11.43,16.51 270 top
C52  22uF  [AXIAL-5MM]  4.57,25.15 270 top
C53  DNP  [AXIAL-5MM]  2.03,25.15 270 top
C54  1000pF  [C0603]  129.54,55.88 90 top
C55  0.1uF  [C0402]  36.83,99.06 90 top
C56  0.1uF  [C0402]  49.53,99.06 90 top
C57  4.7nF  [C0402]  146.56,38.35 180 top
C58  0.1uF  [C0402]  137.16,39.37 0 top
C59  0.1uF  [C0402]  132.84,39.37 90 top
C60  0.1uF  [C0402]  150.62,20.32 0 top
C61  0.1uF  [C0402]  150.62,22.86 0 top
C62  0.1uF  [C0402]  150.62,25.4 0 top
C63  0.1uF  [C0402]  150.62,27.94 0 top
C64  0.1uF  [C0402]  150.62,33.02 0 top
C65  0.1uF  [C0402]  150.62,35.56 0 top
C66  0.1uF  [C0402]  150.62,38.1 0 top
C67  0.1uF  [C0402]  150.62,40.64 0 top
C68  1uF  [C0603]  78.74,123.19 270 top
C69  8.2pF  [C0603]  76.2,123.19 270 top
C70  0.1uF  [C0402]  77.22,72.39 0 top
C71  0.1uF  [C0402]  74.93,87.63 90 top
C72  0.1uF  [C0402]  62.23,73.15 90 top
C73  0.1uF  [C0402]  62.23,87.12 180 top
C74  10uF  [C0805]  60.96,85.09 180 top
C75  10uF  [C0805]  62.23,88.9 180 top
C76  1uF  [C0402]  77.72,74.42 270 top
C77  0.1uF  [C0402]  111.51,61.72 180 top
C78  0.1uF  [C0402]  113.03,68.58 0 top
C79  1uF  [C0402]  113.03,69.85 0 top
C80  0.1uF  [C0402]  139.7,72.39 180 top
C81  0.1uF  [C0402]  139.7,87.63 180 top
C82  0.1uF  [C0402]  147.32,72.39 270 top
C83  0.1uF  [C0402]  147.57,88.39 270 top
C84  0.1uF  [C0402]  74.93,64.52 90 top
C85  0.1uF  [C0402]  71.88,61.21 90 top
C86  0.1uF  [C0603]  133.35,111.76 0 top
C87  0.1uF  [C0603]  129.54,104.14 90 top
C88  0.1uF  [C0603]  142.24,110.49 0 top
C89  0.1uF  [C0603]  139.7,99.06 180 top
C90  0.1uF  [C0402]  19.05,68.83 180 top
C91  0.1uF  [C0402]  16.51,79.25 180 top
C92  10uF  [C0805]  13.97,82.55 180 top
C93  0.1uF  [C0402]  31.75,76.2 0 top
C94  0.1uF  [C0402]  22.86,85.09 180 top
C95  33nF  [C0603]  22.86,71.12 180 top
C96  0.1uF  [C0402]  36.32,89.41 270 top
C97  0.1uF  [C0402]  49.53,89.15 270 top
C98  10uF  [C0805]  52.07,102.87 0 top
C99  10uF  [C0805]  53.34,99.06 90 top
C100  0.01uF  [C0603]  32.26,88.39 0 top
C101  0.1uF  [C0402]  17.78,76.45 270 top
C102  1uF  [C0402]  133.35,66.04 180 top
C103  1uF  [C0402]  133.35,67.31 180 top
C104  0.1uF  [C0402]  134.11,62.23 270 top
C105  10uF  [C0805]  127,35.56 90 top
C106  10uF  [C0805]  30.48,97.79 0 top
C107  0.1uF  [C0402]  27.94,109.22 270 top
C108  0.1uF  [C0402]  33.27,107.95 90 top
C109  0.1uF  [C0402]  62.23,64.26 90 top
C110  0.1uF  [C0402]  67.31,64.52 90 top
C111  0.1uF  [C0402]  62.23,56.9 270 top
C112  0.1uF  [C0402]  70.36,61.21 90 top
C113  0.01uF  [C0402]  36.83,83.82 0 top
C114  0.1uF  [C0402]  29.21,107.95 90 top
C115  0.1uF  [C0402]  24.13,105.41 180 top
C116  0.1uF  [C0402]  24.13,100.33 180 top
C117  0.1uF  [C0402]  24.13,104.14 180 top
C118  0.1uF  [C0402]  27.94,97.79 270 top
D1  [SOD523]  12.7,95.25 180 top
D2  [SOD523]  12.7,96.52 180 top
D3  [SOD523]  12.7,97.79 180 top
D4  [SOD523]  12.7,99.06 180 top
D5  [SOD523]  12.7,100.33 180 top
D6  [SOD523]  12.7,101.6 180 top
D7  [SOD523]  12.7,102.87 180 top
D8  [SOD523]  12.7,104.14 180 top
D9  [SOD523]  26.67,120.65 90 top
D10  [SOD523]  29.21,118.11 270 top
D11  [SOD523]  31.75,118.11 270 top
D12  [SOD523]  34.29,118.11 270 top
D13  [SOD523]  36.83,118.11 270 top
D14  [SOD523]  39.37,118.11 270 top
D15  [SOD523]  41.91,118.11 270 top
D16  [SOD523]  45.72,115.57 90 top
D17  [SOD523]  48.26,120.65 90 top
D18  [SOD523]  50.8,118.11 270 top
D19  [SOD523]  53.34,118.11 270 top
D20  [SOD523]  55.88,118.11 270 top
D21  [SOD523]  58.42,118.11 270 top
D22  [SOD523]  60.96,118.11 270 top
D23  [SOD523]  63.5,118.11 270 top
D24  [SOD523]  68.58,115.57 0 top
D25  VF30100S  [TO220ABS]  152.4,13.97 180 top
D26  CDBU0130R  [SOD523]  25.4,41.91 0 top
D27  CDBU0130R  [SOD523]  140.97,44.45 0 top
D28  [SOD128]  110.49,20.32 0 top
D29  [SOD128]  110.49,24.13 180 top
D30  [SOD128]  116.84,20.32 180 top
D31  [SOD128]  116.84,24.13 0 top
D32  [SOD128]  97.79,20.32 0 top
D33  [SOD128]  97.79,24.13 180 top
D34  [SOD128]  104.14,20.32 180 top
D35  [SOD128]  104.14,24.13 0 top
D36  [DO201T15]  137.16,19.05 0 top
F1  1.5A  [PTC]  24.13,36.83 180 top
F2  6A  [PTC]  19.05,2.54 180 top
F3  3A  [PTC]  133.35,44.45 0 top
IC1  VNH2SP30  [MULTIPOWERSO-30]  43.18,29.21 180 top
IC2  VNH2SP30  [MULTIPOWERSO-30]  76.2,29.21 180 top
IC3  L298  [MULTIWATT15]  106.68,35.56 180 top
IC4  741G3157DCKR  [DCK_R-PDSO-G6]  109.22,67.31 90 top
IC5  741G3157DCKR  [DCK_R-PDSO-G6]  109.22,63.5 90 top
IC6  93-C46B  [SOT23-6]  15.24,71.12 90 top
IC7  74164DHVQFN14  [DHVQFN14]  62.23,46.99 270 top
IC8  LV8549M  [LSOP-10]  123.19,30.48 270 top
IC9  742G17DCK  [DCK_R-PDSO-G6]  14.99,92.71 90 top
J1  ESPM02200  [ESPM02200]  135.89,11.43 0 top
J2  796689-2  [796689-2]  43.18,10.16 0 top
J3  796689-2  [796689-2]  76.2,10.16 0 top
J4  796689-2  [796689-2]  100.33,10.16 0 top
J5  796689-2  [796689-2]  113.03,10.16 0 top
J6  RJ45SMJ102  [SMJ102-S88I-DS-11]  16.51,118.11 180 top
JARD  ARDUINO_SHIELDNO_SILK  [DUEMILANOVE_VIAS]  156.21,105.41 180 top
JP1  XSYS  [2X10]  3.81,83.82 90 top
JP2  [2X11]  123.19,123.19 0 top
JP3  [2X06]  3.81,109.22 90 top
JP4  [2X06]  35.56,123.19 0 top
JP5  [2X06]  57.15,123.19 0 top
JP6  [1X03]  7.62,99.06 180 top
JP7  [1X03]  45.72,119.38 90 top
JP8  [1X03]  67.31,119.38 90 top
JP9  [1X03]  97.79,124.71 270 top
JP10  [1X03]  100.33,124.71 270 top
JP11  [1X03]  102.87,124.71 270 top
JP12  [1X03]  105.41,124.71 270 top
JP13  M05X2SHD  [2X5-SHROUDED]  45.72,71.12 270 top
JP14  [1X03]  7.62,41.91 0 top
JP15  [1X03]  7.62,39.37 0 top
JP16  [1X03]  7.62,36.83 0 top
JP17  [1X03]  7.62,34.29 0 top
JP18  [1X03]  7.62,31.75 0 top
JP19  [1X03]  7.62,29.21 0 top
JP20  [1X03]  45.72,110.49 270 top
JP21  [1X02]  87.63,73.66 0 top
JP22  PINHD-2X5  [2X05]  99.06,109.22 270 top
JP23  [2X08]  154.94,30.48 90 top
JP24  [1X05]  95.25,52.07 180 top
JP25  [1X05]  95.25,54.61 180 top
JP26  [1X05]  95.25,57.15 180 top
JP27  [1X05]  95.25,59.69 180 top
JP28  [1X04]  120.65,7.62 90 top
JP29  FIDUCIAL1X2  [FIDUCIAL-1X2]  147.32,2.54 0 top
JP30  FIDUCIAL1X2  [FIDUCIAL-1X2]  38.1,109.22 0 top
JP31  FIDUCIAL1X2  [FIDUCIAL-1X2]  143.51,97.79 0 top
L1  68uH  [SLF12565]  35.56,52.07 0 top
L2  4.7uH  [0207/5V]  7.62,21.59 90 top
L3  3.3uH  [PANASONIC_ELL6]  62.23,107.95 180 top
L4  15uH  [IHLP-3232DZ]  153.67,49.53 90 top
L5  [0402]  26.16,111.25 0 top
LED1  [CHIPLED_0603]  129.54,22.86 0 top
LED2  [CHIPLED_0603]  17.78,27.94 270 top
LED3  [CHIPLED_0603]  152.4,59.69 90 top
LED4  [CHIPLED_0603]  43.18,54.61 180 top
LED5  [CHIPLED_0603]  59.69,104.14 270 top
LED6  [CHIPLED_0603]  132.08,114.3 90 top
LED7  [CHIPLED_0603]  19.56,105.41 180 top
LED8  [CHIPLED_0603]  21.59,105.41 180 top
Q1  AO3416  [SOT23-3]  147.32,115.57 270 top
Q2  IPP80N04S3-06  [TO220V]  152.4,11.43 180 top
Q3  AO3416  [SOT23-3]  57.15,100.33 0 top
Q15  IRLML2402  [SOT23-3]  129.54,52.07 270 top
Q16  IRLML6402  [SOT23-3]  128.27,48.26 180 top
R1  2.2  [R0402]  46.99,101.6 90 top
R2  10K  [R0603]  58.42,57.15 90 top
R3  2.2  [R0402]  76.45,74.42 270 top
R4  4.7K  [R0603]  45.72,78.74 270 top
R5  1.5K  [R0402]  142.24,115.57 90 top
R6  10  [R0402]  144.78,115.57 90 top
R7  10  [R0402]  143.51,115.57 90 top
R8  4.7K  [R0603]  48.26,78.74 270 top
R9  100K  [R0402]  140.97,115.57 90 top
R10  1K  [R0603]  129.54,110.49 270 top
R11  4.7K  [R0402]  130.81,100.33 90 top
R12  4.7K  [R0402]  132.08,100.33 90 top
R13  100K  [R0402]  130.81,107.19 90 top
R14  100K  [R0402]  136.4,112.27 270 top
R15  100  [R0402]  143.51,103.12 270 top
R16  1.5K  [R0402]  146.05,106.68 90 top
R17  10  [R0402]  148.59,106.68 90 top
R18  10  [R0402]  147.32,106.68 90 top
R19  100K  [R0402]  148.59,113.03 270 top
R20  27  [R0402]  11.43,68.58 0 top
R21  27  [R0402]  11.43,66.04 0 top
R22  1.5K  [R0402]  11.43,67.31 0 top
R23  470  [R0603]  16,76.2 270 top
R24  33  [R0402]  31.75,82.8 0 top
R25  33  [R0402]  31.75,81.53 0 top
R26  33  [R0402]  31.75,80.01 0 top
R27  33  [R0402]  31.75,77.47 0 top
R28  33  [R0402]  16.51,82.55 90 top
R29  2.2K  [R0402]  17.78,71.12 90 top
R30  10K  [R0603]  20.32,71.12 90 top
R31  1M  [R0603]  10.16,78.74 270 top
R32  100K  [R0402]  9.4,61.72 90 top
R33  33  [R0402]  31.75,78.74 0 top
R34  100K  [R0603]  148.59,6.35 90 top
R35  0.5  [R0805]  118.11,52.07 90 top
R36  100K  [R0603]  3.81,12.7 0 top
R37  1.96K  [0207/5V]  16.51,19.05 180 top
R38  221K  [0207/5V]  16.51,6.35 180 top
R39  4.7K  [R0603]  8.89,85.09 0 top
R40  10K  [R0603]  96.52,88.9 180 top
R41  200  [R0402]  15.24,95.25 0 top
R42  200  [R0402]  15.24,96.52 0 top
R43  200  [R0402]  15.24,97.79 0 top
R44  200  [R0402]  15.24,99.06 0 top
R45  200  [R0402]  15.24,100.33 0 top
R46  200  [R0402]  15.24,101.6 0 top
R47  200  [R0402]  15.24,102.87 0 top
R48  200  [R0402]  15.24,104.14 0 top
R49  200  [R0402]  26.67,118.11 270 top
R50  200  [R0402]  27.94,118.11 270 top
R51  200  [R0402]  30.48,118.11 270 top
R52  200  [R0402]  33.02,118.11 270 top
R53  200  [R0402]  35.56,118.11 270 top
R54  200  [R0402]  38.1,118.11 270 top
R55  200  [R0402]  40.64,118.11 270 top
R56  200  [R0402]  43.18,118.11 270 top
R57  200  [R0402]  48.26,118.11 270 top
R58  200  [R0402]  49.53,118.11 270 top
R59  200  [R0402]  52.07,118.11 270 top
R60  200  [R0402]  54.61,118.11 270 top
R61  200  [R0402]  57.15,118.11 270 top
R62  200  [R0402]  59.69,118.11 270 top
R63  200  [R0402]  62.23,118.11 270 top
R64  200  [R0402]  64.77,118.11 270 top
R65  100  [R0402]  107.95,114.3 270 top
R66  100  [R0402]  106.68,114.3 270 top
R67  100  [R0402]  105.41,114.3 270 top
R68  100  [R0402]  104.14,114.3 270 top
R69  1K  [R0402]  46.99,41.91 270 top
R70  1K  [R0402]  40.64,41.91 270 top
R71  1K  [R0402]  66.04,50.8 270 top
R72  1K  [R0402]  54.61,50.8 270 top
R73  3.3K  [R0402]  67.31,50.8 90 top
R74  3.3K  [R0402]  55.88,50.8 90 top
R75  1K  [R0402]  58.42,54.61 180 top
R76  10K  [R0402]  102.87,50.8 270 top
R77  1.5K  [R0402]  104.14,52.07 270 top
R78  0.5  [R0805]  121.92,52.07 90 top
R79  2.7K  [R0603]  87.63,77.47 90 top
R80  2.7K  [R0603]  90.17,77.47 90 top
R81  11K  [R0603]  27.94,49.53 90 top
R82  18K  [R0603]  26.67,57.15 0 top
R83  0.3  [R0402]  22.86,54.61 270 top
R84  1.8K  [R0603]  59.94,112.01 0 top
R85  6.8K  [R0603]  56.64,112.01 0 top
R86  2.32K  [R0402]  30.48,107.95 90 top
R87  49.9  [R0402]  25.4,109.22 270 top
R88  49.9  [R0402]  26.67,109.22 90 top
R89  49.9  [R0402]  32,107.95 90 top
R90  49.9  [R0402]  34.54,106.68 90 top
R91  33  [R0402]  51.82,92.96 0 top
R92  33  [R0402]  51.82,94.23 0 top
R93  33  [R0402]  69.6,87.63 90 top
R94  33  [R0402]  68.33,87.63 90 top
R95  1K  [R0603]  21.59,97.79 0 top
R96  330  [R0603]  21.59,101.6 270 top
R97  100K  [R0402]  24.13,101.6 0 top
R100  100  [R0402]  16.51,41.91 90 top
R101  100  [R0402]  17.78,41.91 90 top
R102  100  [R0402]  19.05,41.91 90 top
R103  100  [R0402]  16.51,35.56 90 top
R104  100  [R0402]  17.78,35.56 90 top
R105  100  [R0402]  19.05,35.56 90 top
R106  10K  [R0603]  147.32,52.07 0 top
R107  3.24K  [R0603]  143.51,52.07 0 top
R108  10K  [R0603]  119.38,96.52 0 top
R109  10K  [R0603]  121.92,68.58 0 top
R110  1K  [R0402]  78.74,41.91 270 top
R111  1K  [R0402]  72.39,43.18 0 top
R112  1K  [R0402]  71.12,50.8 270 top
R113  1K  [R0402]  69.85,50.8 270 top
R114  1.5K  [R0402]  106.68,52.07 270 top
R115  3.3K  [R0402]  72.39,50.8 90 top
R116  3.3K  [R0402]  68.58,50.8 90 top
R117  1K  [R0402]  58.42,50.8 270 top
R118  10K  [R0402]  105.41,50.8 270 top
R139  2.2K  [R0603]  132.08,22.86 0 top
R140  2K  [R0603]  21.59,30.48 90 top
R141  2.4K  [R0603]  147.32,62.23 180 top
R142  1K  [R0603]  43.18,50.8 270 top
R143  1K  [R0603]  60.96,101.6 270 top
R144  47K  [R0402]  28.96,73.66 180 top
R145  41.2K  [0207/5V]  16.51,24.13 180 top
R146  66.5K  [0207/5V]  19.05,10.16 180 top
R147  10K  [R0603]  16.51,12.7 270 top
R148  330K  [R0603]  130.81,48.26 270 top
R149  39K  [R0603]  127,52.07 270 top
R150  10K  [R0603]  127,55.88 270 top
U1  XS1-L2-SPLIT  [124QFN]  43.18,93.98 90 top
U2  XS1-L2-SPLIT  [124QFN]  68.58,78.74 0 top
U3  STM32L151V8T6  [LQFP100]  124.46,85.09 0 top
U4  SST25VF010A  [SO-08]  52.07,59.69 90 top
U5  NCP303LSN09  [SOT23-5]  30.48,71.12 180 top
U6  NC7WZ07  [SC70-6]  32.51,74.17 270 top
U7  MC34063SMD  [SO08]  24.13,49.53 0 top
U8  TPS54620  [S-PVQFN-N14]  7.62,13.97 0 top
U9  FAN2012  [MLP6]  55.88,109.22 180 top
U10  TPS5431  [R-PDSO-G08]  142.24,48.26 180 top
U11  [DCT-R-PDSO-G8]  113.03,64.77 0 top
U12  [DQS_R-PUSON-N20]  62.23,60.96 180 top
U13  HMC5883LSMD  [16LPCC]  93.98,67.31 0 top
U14  MMA845XQ  [VQFN-16]  88.9,90.17 0 top
U15  L3GD20  [LGA16-4X4]  96.52,80.01 0 top
U16  AMIS-39101  [SO-28W]  139.7,30.48 0 top
U17  [PW_R-PDSO-G08]  31.75,85.09 270 top
U18  FT2232D  [PQFP48]  24.13,78.74 90 top
U19  [DQS_R-PUSON-N20]  67.31,60.96 180 top
U20  [DQS_R-PUSON-N20]  74.93,60.96 180 top
U21  [DQS_R-PUSON-N20]  143.51,87.63 270 top
U22  [DQS_R-PUSON-N20]  143.51,72.39 270 top
U23  STM32F103C8T6  [TQFP48]  137.16,105.41 270 top
U24  ENC28J60QFN28  [QFN28-ML_6X6MM]  29.21,102.87 180 top
U$5  [STAND-OFF]  154.94,123.19 0 top
U$6  [STAND-OFF]  154.94,3.81 0 top
U$7  [STAND-OFF]  3.81,3.81 0 top
U$8  [STAND-OFF]  3.81,123.19 0 top
X1  MINI-USB-UX60-MB-5S8  [UX60-MB-5S8]  160.02,111.76 180 top
X2  USD-SOCKETNEW  [MICRO-SD-SOCKET-PP]  17.78,58.42 90 top
X3  XBEE-1B1  [XBEE-1]  82.55,104.14 0 top
X4  MINI-USB-UX60-MB-5S8  [UX60-MB-5S8]  143.51,128.27 270 top
X5  MINI-USB-UX60-MB-5S8  [UX60-MB-5S8]  -1.27,63.5 0 top
Y1  ASFL1-20.000MHZ-L-T  [ASF]  27.94,88.9 180 top
Y2  CSTCR6M00G53Z  [CSTCR6M]  12.7,78.74 270 top

## Tracks (layer width: path | path; a pad name or v marks a point on that pad's centre or on a via)
1.0V  (via drill 0.25, 0.38)
  Top 0.203: U2.B5 64.75,79.99 64.77,80.01 v65.79,80.01 | U1.B5 41.93,90.4 41.91,90.42 v41.91,91.19
  Top 0.254: U2.B43 72.33,83.24 U2.A53 72.33,84.01 72.64,84.33 73.15,84.33 74.93,86.11 C71.1 75.55,86.98 75.95,87.38 v75.95,88.14 | U2.B56 65.33,82.24 v65.53,82.04 | U1.A68 38.68,90.23 U1.B56 39.68,90.73 v39.88,90.93 | U1.A53 38.68,97.73 U1.B43 39.93,97.23 v40.13,97.03 | U1.A34 47.68,97.73 U1.B28 | U1.A19 47.68,90.23 U1.B15 | v54.36,75.18 54.61,75.18 | 54.61,75.18 54.86,75.18 | U5.2 30.48,71.63 30.99,71.12 v34.04,71.12 | 54.36,98.04 54.86,98.55 55.37,98.04 | C55.1 36.21,98.41 35.81,98.81 35.81,100.33 36.83,101.35 36.83,102.62 v37.34,103.12 | 54.61,75.18 54.86,75.44 | 54.61,75.18 54.86,74.93 | Q3.1 56.2,98.81 56.9,98.11
  Top 0.305: U2.B15 64.83,74.24 U2.A19 64.83,73.47 64.52,73.15 63.5,73.15 62.85,72.5 C72.1 62.23,71.88 v61.72,71.37 | U2.B56 64.83,83.24 U2.A68 64.83,83.76 64.52,84.07 64.52,85.34 64.01,85.85 64.01,86.61 63.5,87.12 C73.1 62.88,87.77 63.18,88.07 C75.1 | U2.B28 72.33,74.24 U2.A34 72.33,73.47 73.41,72.39 C70.1 | v54.86,71.37 54.86,74.93 54.86,75.18 54.86,75.44 54.86,86.87 55.63,87.63 58.67,87.63 59.18,88.14 59.18,89.66 60.2,90.68 62.48,90.68 | U1.A34 48.2,97.73 48.88,98.41 C56.1 50.18,98.41 50.48,98.11 C99.1 v53.34,97.03 | v51.05,89.92 50.94,89.8 C97.1 48.88,89.8 48.45,90.23 U1.A19 | R1.2 46.99,103.63 v47.5,104.14 54.1,104.14 54.86,103.38 54.86,98.55 54.86,98.11 | v79.5,71.88 78.74,71.12 76.96,71.12 76.57,71.52 C70.1 | C70.1 76.57,73.04 76.45,73.15 R3.2 | 62.48,90.68 62.74,90.68 | 62.48,90.68 62.74,90.93 | 62.48,90.68 62.74,90.42 | C96.1 37.73,90.06 37.91,90.23 U1.A68 | U1.A53 38.16,97.73 37.48,98.41 C55.1
  Top 0.406: C10.1 C35.1 65.72,107.31 L3.1 65.08,110.18 63.25,112.01 R84.2 | C99.1 54.86,98.11 56.9,98.11 60.77,98.11 61.4,98.74 64.89,98.74 65.72,99.57 | v62.74,91.19 62.74,90.93 62.74,90.68 62.74,90.42 62.74,90.17 63.18,89.73 C75.1 | v67.82,96.01 67.06,96.77 67.06,99.82 66.55,100.33 C10.1 | 65.72,99.57 C10.1 | v62.74,97.28 63.25,97.79 65.28,97.79 65.72,98.23 65.72,99.57
  Bottom 0.203: v65.79,80.01 66.04,80.26 66.04,81.53 v65.53,82.04 | v41.91,91.19 41.15,91.95 41.15,92.46
  Bottom 0.254: v54.36,75.18 38.1,75.18 v34.04,71.12 | v39.88,90.93 41.15,92.2 41.15,92.46 41.15,96.01 v40.13,97.03 | v37.34,103.12 42.16,103.12 43.18,104.14 v47.5,104.14
  Bottom 0.305: v54.86,71.37 55.37,70.87 61.21,70.87 v61.72,71.37 | v75.95,88.14 76.45,87.63 79.5,87.63 80.01,87.12 80.01,72.39 v79.5,71.88 | v51.05,89.92 53.34,92.2 v53.34,97.03
  Bottom 0.406: v62.74,91.19 v62.74,97.28 | v67.82,96.01 70.87,96.01 75.95,90.93 v75.95,88.14
3.3V  (via drill 0.25)
  Top 0.203: U23.24 139.91,100.37 140.55,99.73 C89.1 v141.73,99.06 | U23.9 131.59,104.16 130.72,103.29 C87.1 | U23.48 133.42,109.91 132.5,110.83 | U23.1 132.66,109.66 132.5,109.82 132.5,110.83 | U23.36 141.66,109.04 141.39,109.31 C88.1 141.39,112.69 v141.73,113.03 | C86.1 132.5,110.83
  Top 0.254: LED6.A 133.35,114.3 v133.86,113.79 132.5,112.43 C86.1 | v128.02,103.63 128.36,103.29 C87.1 129.54,100.08 129.94,99.68 R11.1
  Top 0.305: v144.78,113.03 145.05,113.3 145.81,113.3 146.32,113.81 Q1.2
  Bottom 0.203: v144.78,113.03 144.53,112.78 144.53,101.85 v141.73,99.06
  Bottom 0.254: v133.86,113.79 133.1,113.79 132.59,113.28 129.03,113.28 128.02,112.27 v128.02,103.63
  Bottom 0.305: v133.86,113.79 138.18,113.79 138.94,113.03 v141.73,113.03 v144.78,113.03
+3V3  (via drill 0.25, 0.38, 0.51)
  Top 0.203: U2.B36 72.14,78.99 v71.88,78.99 | v71.88,77.98 72.14,77.98 72.15,77.99 U2.B34 U2.B33 U2.B32 | U2.B4 65,80.49 65.02,80.52 v65.28,80.52 | U1.B4 41.43,90.4 41.4,90.42 v41.4,90.68 | v43.94,96.77 43.94,97.54 43.93,97.55 U1.B34 U1.B33 U1.B32 | U12.5 62.43,62.54 v62.23,62.74 62.03,62.54 U12.6 | U19.5 67.51,62.54 v67.31,62.74 67.11,62.54 U19.6 | U20.5 75.13,62.54 v74.93,62.74 74.73,62.54 U20.6 | U21.6 141.42,87.43 v141.22,87.63 141.42,87.83 U21.5 | U22.5 141.42,72.59 v141.22,72.39 141.42,72.19 U22.6
  Top 0.254: U2.B29 73.08,74.99 U2.A36 73.85,74.99 v74.17,74.68 74.17,74.17 74.56,73.77 C33.1 | U1.A17 46.93,89.48 U1.B14 | U1.A2 39.43,89.48 U1.B1 | U1.A51 39.43,98.48 U1.B42 | U1.B29 46.93,98.48 U1.A36 46.93,99 46.99,99.06 46.99,99.31 47.5,99.82 v47.75,99.82 48.26,100.33 C12.1 48.88,100.95 49.28,101.35 49.28,102.36 49.78,102.87 C98.1 | v62.23,62.74 C109.1 | v67.31,62.74 C110.1 | v74.93,62.74 C84.1 | C21.1 90.68,66.04 v90.93,66.29 | U13.4 91.2,66.56 v90.93,66.29 | U13.2 92.2,67.56 v90.93,66.29 | C22.1 95.67,71.29 v95,70.61 94.73,70.35 U13.13 | R79.2 87.63,78.99 v88.9,80.26 90.17,78.99 R80.2 | C29.1 91.34,81.6 C28.1 | U15.4 93.77,79.03 93.47,78.74 93.47,77.22 v93.73,76.96 95.25,76.96 95.55,77.26 U15.5 | U14.1 86.88,91.17 86.11,91.95 86.11,93.73 v85.85,93.98 C23.1 | U14.7 88.9,86.61 v89.15,86.36 89.4,86.61 U14.8 | C80.1 v141.22,72.39 | C81.1 v141.22,87.63 | U11.3 113.36,62.05 v113.03,61.72 C77.1 | IC5.5 107.7,63.5 107.44,63.25 v107.44,62.48 | IC4.5 107.7,67.31 v107.44,67.06 | C3.1 R2.2 | C3.1 59.35,60.11 v59.44,60.2 | U4.3 57.02,60.33 57.24,60.11 C3.1 | U4.8 47.88,57.78 v47.75,57.91 | U4.7 47.88,59.05 v47.75,58.93 | R8.1 v48.26,81.03 | v80.26,123.44 79.67,124.04 C68.1 C69.1 76.1,124.14 X3.1 | v95.5,93.47 95.32,93.66 C24.1 89.85,93.66 89.4,93.21 U14.14 | Y1.4 Y1.1 | R16.1 v146.05,105.16 | R13.2 v130.81,108.71 | Q1.3 v149.35,115.57 | v142.24,114.05 R5.1 | C94.1 23.51,85.96 v23.37,86.11 | C94.1 23.38,84.96 U18.32 U18.31 | U18.10 25.88,73.18 v25.91,73.15 | C93.1 30.48,76.2 v30.23,76.45 30.19,76.49 U18.14 | U18.26 26.38,84.11 25.4,85.09 C94.1 | R144.2 28.31,72.79 v28.45,72.64 | U6.5 34.04,74.17 v34.29,73.91 | X2.4 11.38,52.78 v11.43,52.83
  Top 0.254: BAT1.3 134.97,66.39 134.62,66.04 C102.1 134,65.17 v133.86,65.02 | R108.1 117.86,96.52 117.6,96.77 v117.6,97.28 | R109.1 120.14,68.58 119.89,68.33 v119.89,67.82 | U24.11 v29.21,106.43 C114.1 | R4.1 45.72,80.77 v45.97,81.03 | C113.1 36.18,84.47 35.88,84.77 U17.6 33.46,84.77 v33.27,84.58 | v31.75,87.38 31.41,87.72 C100.1 30.73,88.39 30.09,87.75 Y1.4 | Y1.4 29.21,87.73 | U17.2 27.76,85.42 v27.69,85.34 | R39.2 9.74,86.02 v9.65,86.11 | IC9.5 v13.21,92.71 | v26.92,98.3 27.07,98.44 C118.1 27.94,99.06 28.56,99.68 U24.24 | v23.62,107.19 24.78,106.03 C115.1 25.4,105.41 25.99,104.82 U24.15 | Q3.3 57.15,102.11 v56.64,102.62 | LED7.A v19.56,107.19 | LED8.A v21.59,107.19 | L5.2 27.94,111.25 v28.45,111.76 | U24.16 25.68,104.17 v25.65,104.14 C117.1 | U24.21 25.74,100.92 v25.65,100.84 25.15,100.33 C116.1
  Top 0.305: U2.B42 73.08,82.49 U2.A51 74.36,82.49 v74.68,82.8 75.04,83.17 C4.1 | U2.B1 64.08,82.49 U2.A2 63.31,82.49 62.99,82.8 C6.1 61.61,83.71 61.91,84.01 C74.1 62.99,85.09 63.25,85.34 v63.25,85.85 | U2.B14 64.08,74.99 U2.A17 63.31,74.99 63.25,74.93 61.47,74.93 v61.21,74.68 60.96,74.42 C5.1 | v88.9,80.26 C29.1 | U16.27 132.72,36.45 132.84,36.58 132.84,37.59 | U16.26 133.99,36.45 132.84,37.59 | 132.84,37.59 C59.1 133.46,38.72 133.86,39.12 133.86,41.91 133.35,42.42 133.35,50.04 v133.1,50.29 | C13.1 47.36,87.77 v46.99,88.14 46.93,88.2 U1.A17 | v36.32,86.61 38.61,86.61 39,87.01 C14.1 39,88.28 39.43,88.71 U1.A2 | U1.A51 39.43,99.76 39,100.19 C11.1 39,102 v39.12,102.11
  Top 1.016: L1.2 v35.56,60.96
  Top 1.27: L1.2 37.5,57.57 37.59,57.66 | L1.2 35.56,55.63 | L1.2 33.87,57.57 33.78,57.66
  other vias: 29.21,55.88 31.75,55.88 31.75,58.42 38.1,60.96 38.1,58.42 33.02,60.96 35.56,53.34 38.1,55.88 40.64,55.88 40.64,60.96 43.18,60.96 43.18,58.42 40.64,58.42 29.21,53.34 31.75,53.34 38.1,53.34 40.64,53.34 44.45,53.34 44.45,55.88
  pour $Power (isolate 0.305, rank 6): 0,126.75 0,54.61 5.08,49.53 133.35,49.53 152.4,66.8 152.4,102.36 158.5,108.46 158.5,126.75
  pour Top: 93.47,80.77 95.25,80.77 95.25,81.28 96.52,81.28 96.52,83.06 93.98,83.06 93.98,82.55 88.14,82.55 88.14,81.03 93.47,81.03
  pour Top (isolate 0.305): 26.67,52.07 26.67,58.42 29.21,58.42 29.21,62.23 44.96,62.23 44.96,52.07
+5V  (via drill 0.25, 0.38, 0.51, 0.6, 0.76, 1)  (2 unrouted)
  Top 0.203: R74.2 55.88,52.07 v56.13,52.32 | R115.2 72.39,52.07 v72.64,52.32 | v111.51,69.85 C79.1 | 71.12,58.93 71.12,52.83 v71.63,52.32 | U12.16 62.43,58.37 62.23,58.17 C111.1 61.86,57.55 61.47,57.15 v61.47,52.58 | v148.34,73.41 147.97,73.04 C82.1 146.19,73.04 145.74,72.59 U22.16 | v149.1,88.39 148.45,89.04 C83.1 146.95,89.04 145.74,87.83 U21.16 | 71.12,58.93 70.36,59.69 C112.1 69.74,60.56 69.34,60.96 67.82,60.96 67.51,60.65 U19.16 | 71.12,58.93 71.88,59.69 C85.1 72.5,60.56 72.9,60.96 74.93,60.96 75.13,60.76 U20.16 | v62.99,52.32 62.74,52.07 C48.1 62.37,51.45 61.98,51.06 IC7.1 | IC7.1 IC7.14 | IC7.1
  Top 0.254: C79.1 C78.1 112.38,67.96 112.7,67.64 U11.7 | v149.35,83.31 156.97,83.31 | R73.2 67.31,52.07 v67.56,52.32 | R116.2 68.58,52.07 v68.83,52.32 | U18.42 18.29,78.99 18.03,79.25 C91.1 17.16,79.87 16.26,80.77 15.75,80.77 14.92,81.6 C92.1 | U18.4 U18.3 22.38,72.93 v21.84,72.39 | C90.1 20.07,68.83 20.32,69.09 R30.1 | C90.1 v21.08,68.83 | R23.2 11.77,75.35 v11.18,75.95 11.18,71.12 12.13,70.17 IC6.6 14.92,70.17 15.24,69.85 15.24,69.6 15.75,69.09 v16.26,69.09 | v18.8,69.85 19.3,69.85 19.7,69.45 C90.1 | 155.19,61.21 154.94,60.96 | JP24.2 92.71,51.82 94.49,50.04 97.54,50.04 98.3,49.28 98.3,44.7 101.94,41.06 C47.1 105.41,39.12 105.47,39.06 IC3.9
  Top 0.406: 52.58,110.17 U9.4 | 52.58,110.17 C9.1 v52.07,112.27 | U9.5 53.53,109.22 52.58,110.17 | JARD.5V 103.63,88.9 v102.87,89.66 | C92.1 14.92,83.89 v14.48,84.33
  Top 0.61: JP24.2 JP25.2 JP26.2 JP27.2
  Top 0.813: v102.87,102.87 v102.87,89.66
  Top 1.93: L4.2 153.67,55.88
  Bottom 0.203: 61.21,52.32 v56.13,52.32 | 61.47,52.32 61.21,52.32 | 61.72,52.32 61.47,52.32 | 61.72,52.32 v62.99,52.32 v67.56,52.32 v68.83,52.32 v71.63,52.32 v72.64,52.32 74.17,52.32 76.45,50.04 80.26,50.04 80.52,49.78 92.2,49.78 92.71,50.29 JP24.2 | v149.1,88.39 149.1,83.57 v149.35,83.31 148.34,82.3 v148.34,73.41 | v111.51,69.85 104.39,69.85 102.87,71.37 | 61.47,52.32 v61.47,52.58 | v61.47,52.58 61.21,52.32 | 61.72,52.32 v61.47,52.58
  Bottom 0.254: v21.84,72.39 21.84,70.87 21.34,70.36 21.34,69.09 v21.08,68.83 | v11.18,75.95 11.18,83.31 10.16,84.33 | v18.8,69.85 17.02,69.85 v16.26,69.09
  Bottom 0.406: JP7.3 44.7,124.46 43.43,125.73 15.75,125.73 13.72,123.7 13.72,116.08 9.14,111.51 9.14,104.14 6.35,101.35 3.05,101.35 2.54,100.84 JP6.3 4.32,97.28 7.37,97.28 8.89,95.76 8.89,85.09 9.65,84.33 10.16,84.33 v14.48,84.33 | 47.75,125.48 47.5,125.22 47.5,115.57 48.26,114.81 51.05,114.81 52.07,113.79 v52.07,112.27
  Bottom 0.61: JP8.3 66.29,124.46 65.02,125.73 48.01,125.73 47.75,125.48 46.74,124.46 JP7.3 | v102.87,89.66 102.87,71.37 102.87,64.77 100.33,62.23 93.98,62.23 92.71,60.96 JP27.2
  Bottom 0.813: JP8.3 68.58,124.46 69.85,125.73 93.98,125.73 97.54,122.17 JP9.2 JP10.2 JP11.2 JP12.2 106.68,122.17 108.46,120.4 108.46,119.13 109.47,118.11 109.47,109.22 111.51,107.19 105.92,107.19 102.87,104.14 v102.87,102.87
  Bottom 1.016: v157.23,105.41 150.62,105.41 147.32,108.71 147.32,115.57 146.05,116.84 123.7,116.84 122.43,115.57 122.43,107.95 121.67,107.19 111.51,107.19
  pour Top: 158.75,50.8 147.32,50.8 147.32,54.36 147.83,54.86 147.83,60.2 148.59,60.96 155.19,60.96 155.19,106.68 158.75,106.68
+12V  (via drill 0.25, 0.38, 1)
  Top 0.254: 39.45,35.23 39.45,33.96 40.64,32.77
  Top 0.406: JARD.VIN 105.16,81.28 103.38,79.5 103.38,56.39 99.57,52.58 99.57,45.72
  Top 0.61: IC2.23 IC2.VCC@1 | IC1.23 IC1.VCC@1 IC1.VCC | 42.16,32.77 43.12,32.77 IC1.VCC | 42.16,32.77 40.89,32.77 | 40.89,32.77 40.64,32.77 | 47.12,33.66 46.23,32.77 45.72,32.77 | 47.12,33.66 48.18,34.72 | 43.69,32.77 43.24,32.77 IC1.VCC | 43.69,32.77 45.72,32.77 | 40.89,32.77 39.12,34.54 | 42.16,32.77 41.53,33.4 | 41.53,33.4 40.13,34.8 | 41.53,33.4 41.15,33.78 | 41.53,33.4 42.16,34.04 | 43.69,32.77 44.2,33.27 44.2,33.78 45.21,34.8 | 45.72,32.77 46.23,33.27 | 47.12,33.66 47.24,33.78
  Top 1.016: 81.2,40.56 IC2.3 81.2,35.23 81.03,35.05 | 71.2,35.48 71.37,35.31 71.2,35.13 71.2,35.05 | 71.2,35.05 71.2,34.46 | 71.2,39.7 IC2.13 71.2,35.05 | 48.18,34.72 IC1.3 48.18,40.05 48.77,40.64 | 38.35,33.53 38.18,33.7 IC1.13 38.18,43.77
  other vias: 143,24.13 143,37.08 136.14,37.34 136.65,23.62 137.16,37.34 148.08,38.35 66.04,36.83 93.98,29.21 38.1,41.91 49.53,41.91 118.36,32.51 81.28,41.91 72.39,34.29 74.93,34.29 77.47,34.29 80.01,34.29 72.39,31.75 74.93,31.75 77.47,31.75 80.01,31.75 39.37,34.29 41.91,34.29 44.45,34.29 46.99,34.29 39.37,31.75 41.91,31.75 44.45,31.75 46.99,31.75 33.02,36.83 33.02,33.02 58.42,36.83 66.04,40.64 66.04,33.02 91.44,36.83 127,44.45 130.81,40.64 71.12,40.64 86.36,41.91 53.34,41.91 99.06,40.64 119.38,41.91 25.4,5.08 25.4,2.54 26.67,29.21 34.29,41.91 26.67,33.02 90.17,3.81 120.65,3.81 57.15,3.81 63.5,3.81 136.4,27.94 136.4,33.02 142.75,27.94 142.75,33.02
  pour Top (isolate 0.305, rank 3): 133.35,46.99 38.1,46.99 29.46,38.35 23.62,38.35 23.62,24.13 24.89,22.86 24.89,9.65 20.57,5.33 19.56,4.06 19.56,0 158.75,0 158.75,41.91 134.62,41.91 133.35,43.18
  pour $Power (isolate 0.254): 20.32,0 19.05,0 19.05,3.81 25.4,10.16 25.4,22.86 21.59,26.67 21.59,29.21 17.78,33.02 17.78,40.64 20.32,40.64 21.59,39.37 33.02,39.37 40.64,46.99 133.35,46.99 133.35,43.18 134.62,41.91 158.75,41.91 158.75,7.62 151.13,7.62 151.13,0
ADCIN_0
  Top 0.254: U3.23 115.4,80.09 114.3,78.99 114.3,76.96 113.54,76.2 JARD.A0
ADCIN_1
  Top 0.254: U3.24 115.91,79.59 115.06,78.74 115.06,75.69 114.3,74.93 108.71,74.93 107.44,73.66 JARD.A1
ADCIN_6
  Top 0.254: JARD.A2 106.68,71.12 109.22,73.66 120.4,73.66 120.96,74.22 U3.31
ADCIN_7
  Top 0.254: JARD.A3 109.73,72.9 120.65,72.9 121.46,73.71 U3.32
ADCIN_8
  Top 0.254: IC4.3 110.07,69.68 111,70.61 113.79,70.61 114.05,70.87 121.63,70.87 122.94,72.17 122.94,76.45 122.96,76.48 U3.35
ADCIN_9  (via drill 0.25)
  Top 0.254: U3.36 123.46,76.47 123.44,76.45 123.44,71.63 121.92,70.1 v121.92,67.06 | v118.11,54.1 R35.2 117.03,53.02 116.33,52.32 116.33,49.78 117.35,48.77 v117.35,44.96
  Bottom 0.254: IC3.15 97.94,37.95 99.31,36.58 116.84,36.58 117.35,37.08 v117.35,44.96 | v121.92,67.06 121.92,64.26 118.11,60.45 v118.11,54.1
ADCIN_10
  Top 0.254: U3.15 110.73,84.09 108.71,86.11 108.71,97.54 108.2,98.04 108.2,109.98 107.95,110.24 R65.2
ADCIN_11
  Top 0.254: U3.16 109.96,83.59 108.2,85.34 108.2,97.03 107.19,98.04 107.19,108.71 106.68,109.22 R66.2
ADCIN_12
  Top 0.254: U3.17 109.19,83.09 107.7,84.58 107.7,96.27 106.17,97.79 106.17,106.68 105.41,107.44 R67.2
ADCIN_13
  Top 0.254: U3.18 108.42,82.59 107.19,83.82 107.19,95.76 105.16,97.79 105.16,105.41 104.14,106.43 R68.2
ADCIN_15  (via drill 0.25)
  Top 0.254: IC5.3 110.63,64.15 111.25,64.77 113.03,64.77 v113.28,65.02 | v113.28,71.37 113.54,71.63 121.36,71.63 122.43,72.69 122.43,76.45 122.46,76.49 U3.34
  Bottom 0.254: v113.28,65.02 v113.28,71.37
ADCIN_22  (via drill 0.25)
  Top 0.254: U3.38 124.46,68.33 123.7,67.56 v123.7,67.06 | v123.19,59.69 C31.1 121.5,58.76 121.16,58.42 117.35,58.42 115.82,56.9 105.92,56.9 102.87,53.85 R76.1
  Bottom 0.254: v123.7,67.06 123.7,60.2 v123.19,59.69
ADCIN_23  (via drill 0.25)
  Top 0.254: U3.39 124.96,76.46 124.97,76.45 124.97,68.07 v124.46,67.56 | v123.7,57.15 C43.1 121.5,55.46 120.9,54.86 106.17,54.86 105.41,54.1 R118.1
  Bottom 0.254: v123.7,57.15 124.46,57.91 v124.46,67.56
ADCIN_24  (via drill 0.25)
  Top 0.254: U3.40 125.46,76.47 125.48,76.45 125.48,67.82 125.22,67.56 v125.22,67.06 | v119.13,45.97 119.63,46.48 119.63,52.32 120.33,53.02 R78.2 121.92,54.1 122.43,54.61 v123.95,54.61
  Bottom 0.254: v123.95,54.61 125.22,55.88 v125.22,67.06 | IC3.1 115.63,38.41 115.82,38.61 115.82,45.47 116.33,45.97 v119.13,45.97
ADCIN_25  (via drill 0.25)
  Top 0.254: U3.41 125.96,76.48 125.98,76.45 v125.98,67.56 | R149.1 R150.2 | R150.2 C54.1 | R150.2 126.33,55.03 125.98,55.37 v125.98,58.93
  Bottom 0.254: v125.98,58.93 v125.98,67.56
ARDUINO_A4
  Top 0.254: IC4.4 107.33,67.96 JARD.A4
ARDUINO_A5
  Top 0.254: IC5.4 106.06,64.15 JARD.A5
ARDUINO_D2
  Top 0.203: U22.13 145.02,71.39 145.54,70.87 145.54,70.61 147.57,68.58 JARD.D2
ARDUINO_D3
  Top 0.203: U22.14 145.38,71.79 146.56,70.61 148.84,70.61 149.35,71.12 JARD.D3
ARDUINO_D4
  Top 0.203: U22.18 145.78,73.39 146.56,74.17 153.16,74.17 JARD.D4
ARDUINO_D5
  Top 0.203: U22.19 145.42,73.79 146.3,74.68 152.15,74.68 JARD.D5
ARDUINO_D6
  Top 0.203: U22.20 145.06,74.19 146.05,75.18 150.11,75.18 JARD.D6
ARDUINO_D7
  Top 0.203: U21.11 145.31,85.83 145.8,85.34 147.32,85.34 148.08,84.58 148.08,83.06 149.86,81.28 JARD.D7
ARDUINO_D8
  Top 0.203: U21.12 145.67,86.23 146.05,85.85 152.91,85.85 JARD.D8
ARDUINO_D9
  Top 0.203: U21.13 146.03,86.63 146.3,86.36 150.88,86.36 152.15,87.63 JARD.D9
ARDUINO_D10
  Top 0.203: U21.14 146.4,87.03 146.56,86.87 150.37,86.87 JARD.D10
ARDUINO_D11
  Top 0.203: U21.18 145.78,88.63 147.07,89.92 150.88,89.92 JARD.D11
ARDUINO_D12
  Top 0.203: U21.19 145.42,89.03 146.81,90.42 149.35,90.42 151.13,92.2 151.13,92.71 JARD.D12
ARDUINO_D13
  Top 0.203: JARD.D13 150.88,95 150.88,94.49 150.11,93.73 150.11,92.46 148.59,90.93 146.3,90.93 144.8,89.43 U21.20
ARDUINO_RX
  Top 0.203: U22.11 144.24,69.63 150.37,63.5 JARD.RX
ARDUINO_TX
  Top 0.203: U22.12 144.66,70.99 145.03,70.61 145.03,69.85 148.84,66.04 JARD.TX
BAT1_CN
  Top 0.254: BAT1.10 135,61.84 134.73,61.58 C104.2
BAT1_CP
  Top 0.254: BAT1.9 135.12,62.49 134.73,62.88 C104.1
BAT1_VCHGBAT  (via drill 0.25)
  Top 0.254: BAT1.1 136.26,67.95 135.89,68.33 v135.13,68.33 | v135.13,65.79 135.17,65.75 BAT1.4
  Bottom 0.254: v135.13,68.33 134.87,68.07 134.87,66.04 v135.13,65.79
BOOT0
  Top 0.254: U3.94 121.46,94.19 120.23,95.42 R108.2
BOOT1
  Top 0.254: U3.37 123.96,76.72 123.95,76.71 123.95,69.09 123.44,68.58 R109.2
BOOT_SEL  (via drill 0.25)
  Top 0.203: U1.B36 42.93,97.54 v42.93,97.28 | v43.18,107.44 43.18,103.38 v43.43,103.12
  Top 0.254: U1.B36 U1.B35
  Bottom 0.203: v42.93,97.28 42.93,100.58 43.94,101.6 43.94,102.62 v43.43,103.12 | v43.18,107.44 43.69,107.95 JP20.2
C27_R40
  Top 0.203: C27.2 95.25,87.88 95.67,88.3 R40.2
CLK
  Top 0.305: Y1.3 26.69,86.59 27.22,86.06 U17.1
DEBUG_N  (via drill 0.25)  (2 unrouted)
  Top 0.203: U2.B37 72.15,79.49 72.14,79.5 v71.37,79.5 | U1.B37 42.43,97.55 42.42,97.54 v42.42,96.77 | R33.2 33.53,78.74 33.78,78.99 v36.58,78.99 v40.64,78.99
  Bottom 0.203: v42.42,96.77 41.66,96.01 41.66,92.46 42.93,91.19 42.93,88.65 42.16,87.88 37.85,87.88 36.83,86.87 36.83,79.25 v36.58,78.99 | v71.37,79.5 71.12,79.5 70.61,78.99 70.61,77.47 70.1,76.96 67.06,76.96 66.55,77.47 66.55,78.49 66.04,78.99 64.52,78.99 64.26,79.25 40.89,79.25 v40.64,78.99
EEPROM_!SS  (via drill 0.25)
  Top 0.254: R2.1 57.49,56.3 56.01,57.78 U4.1 52.7,57.78 v52.58,57.91 | v44.45,74.42 44.45,80.52 47.24,83.31 47.24,85.85 46.43,86.67 U1.A16